# Altium project ESC_4in1.PrjPcb
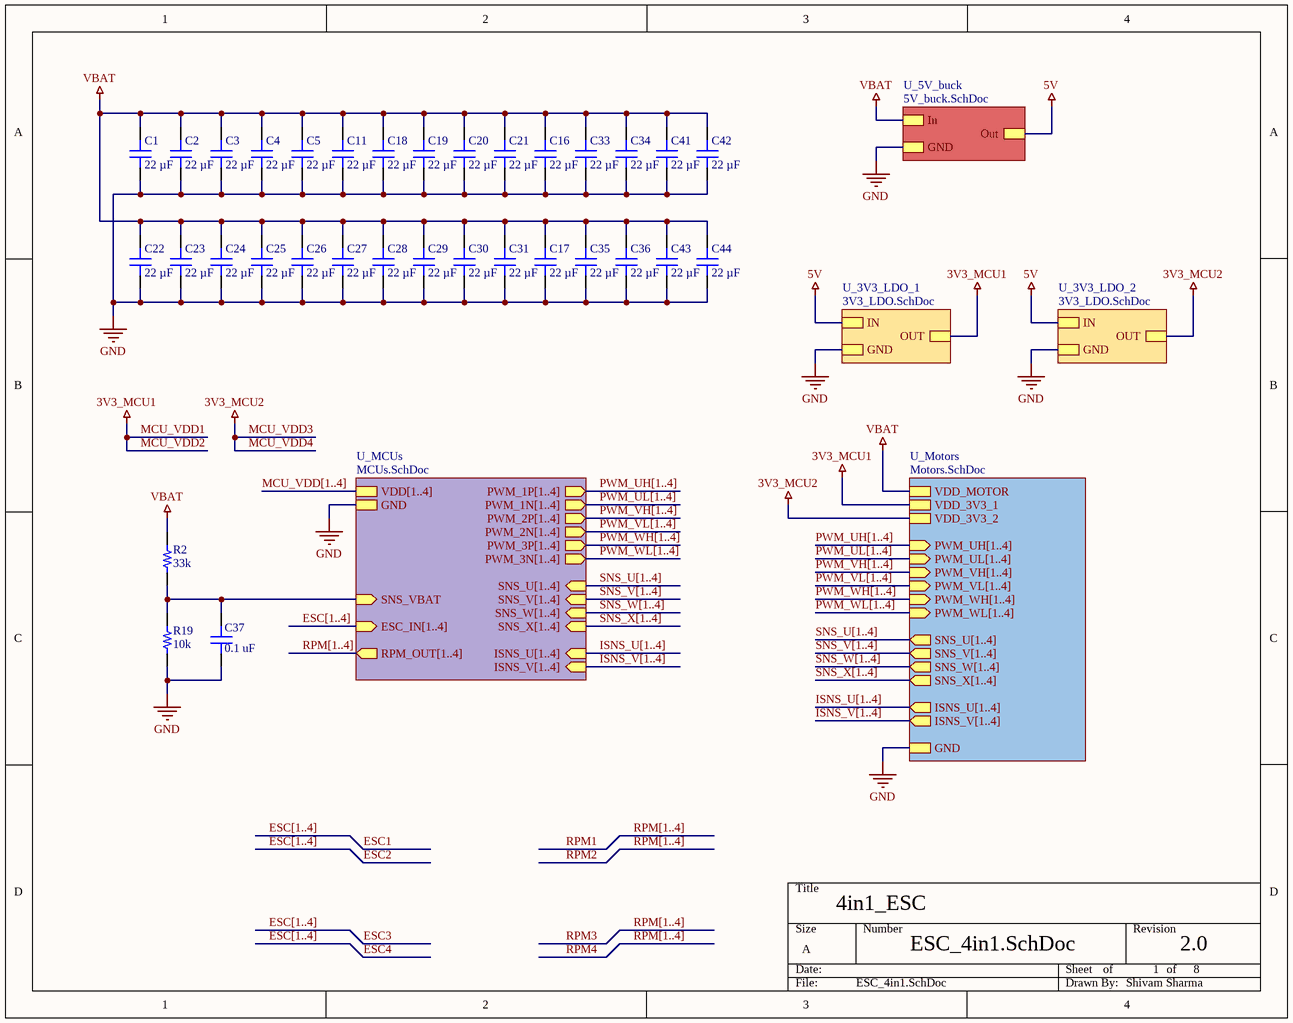
[diagram p0: ESC_4in1.SchDoc]
Revision: 2.1; Project: 4in1_ESC; DrawnBy: Shivam Sharma
8 sheets, 216 parts. Net scope: strictly hierarchical (ports join the sheet entries above them; power ports are local).
Board file: ESC_4in1_8layer.PcbDoc
Sheets:
  ESC_4in1.SchDoc
    U_5V_buck = 5V_buck.SchDoc
    U_3V3_LDO_1 = 3V3_LDO.SchDoc
    U_Motors = Motors.SchDoc
      U_MOSFETs1 = MOSFETs.SchDoc
      U_MOSFETs2 = MOSFETs.SchDoc
      U_MOSFETs3 = MOSFETs.SchDoc
      U_MOSFETs4 = MOSFETs.SchDoc
      U_Half Bridge Driver_1 = Half_Bridge_Driver.SchDoc
      U_Half Bridge Driver_2 = Half_Bridge_Driver.SchDoc
      U_Half Bridge Driver_3 = Half_Bridge_Driver.SchDoc
      U_Half Bridge Driver_4 = Half_Bridge_Driver.SchDoc
      U_CurrentSenseAmp = CurrentSenseAmp.SchDoc
      U_CurrentSenseAmp = CurrentSenseAmp.SchDoc
      U_CurrentSenseAmp = CurrentSenseAmp.SchDoc
      U_CurrentSenseAmp = CurrentSenseAmp.SchDoc
    U_MCUs = MCUs.SchDoc
    U_3V3_LDO_2 = 3V3_LDO.SchDoc

## Sheet ESC_4in1.SchDoc
size A; Revision: 2.0; SheetNumber: 1; SheetTotal: 8

### Parts
C1  22 µF  [CAP 0805_2012]
C2  22 µF  [CAP 0805_2012]
C3  22 µF  [CAP 0805_2012]
C4  22 µF  [CAP 0805_2012]
C5  22 µF  [CAP 0805_2012]
C11  22 µF  [CAP 0805_2012]
C16  22 µF  [CAP 0805_2012]
C17  22 µF  [CAP 0805_2012]
C18  22 µF  [CAP 0805_2012]
C19  22 µF  [CAP 0805_2012]
C20  22 µF  [CAP 0805_2012]
C21  22 µF  [CAP 0805_2012]
C22  22 µF  [CAP 0805_2012]
C23  22 µF  [CAP 0805_2012]
C24  22 µF  [CAP 0805_2012]
C25  22 µF  [CAP 0805_2012]
C26  22 µF  [CAP 0805_2012]
C27  22 µF  [CAP 0805_2012]
C28  22 µF  [CAP 0805_2012]
C29  22 µF  [CAP 0805_2012]
C30  22 µF  [CAP 0805_2012]
C31  22 µF  [CAP 0805_2012]
C33  22 µF  [CAP 0805_2012]
C34  22 µF  [CAP 0805_2012]
C35  22 µF  [CAP 0805_2012]
C36  22 µF  [CAP 0805_2012]
C37  0.1 uF  [CAP 0201_0603]
C41  22 µF  [CAP 0805_2012]
C42  22 µF  [CAP 0805_2012]
C43  22 µF  [CAP 0805_2012]
C44  22 µF  [CAP 0805_2012]
R2  33k  [RES 0201_0603]
R19  10k  [RES 0201_0603]

### Sub-sheets
U_3V3_LDO_1 = 3V3_LDO.SchDoc: OUT, IN, GND
U_3V3_LDO_2 = 3V3_LDO.SchDoc: OUT, IN, GND
U_5V_buck = 5V_buck.SchDoc: Out, In, GND
U_MCUs = MCUs.SchDoc: GND, PWM_1P[1..4] (out), PWM_1N[1..4] (out), PWM_2P[1..4] (out), PWM_2N[1..4] (out), PWM_3P[1..4] (out), PWM_3N[1..4] (out), SNS_U[1..4] (in), SNS_V[1..4] (in), SNS_W[1..4] (in), SNS_X[1..4] (in), ISNS_U[1..4] (in), ESC_IN[1..4] (in), RPM_OUT[1..4] (out), SNS_VBAT (in), VDD[1..4], ISNS_V[1..4] (in)
U_Motors = Motors.SchDoc: VDD_MOTOR, GND, PWM_UH[1..4] (in), PWM_UL[1..4] (in), PWM_VH[1..4] (in), PWM_VL[1..4] (in), PWM_WH[1..4] (in), PWM_WL[1..4] (in), SNS_U[1..4] (out), SNS_V[1..4] (out), SNS_W[1..4] (out), SNS_X[1..4] (out), VDD_3V3_1, ISNS_U[1..4] (out), ISNS_V[1..4] (out), VDD_3V3_2

### Nets
3V3_MCU1: sheet U_3V3_LDO_1/OUT, sheet U_Motors/VDD_3V3_1  [also labelled MCU_VDD1, MCU_VDD2]
3V3_MCU2: sheet U_Motors/VDD_3V3_2, sheet U_3V3_LDO_2/OUT  [also labelled MCU_VDD3, MCU_VDD4]
5V: sheet U_5V_buck/Out, sheet U_3V3_LDO_1/IN, sheet U_3V3_LDO_2/IN
GND: C1.1 C2.1 C3.1 C4.1 C5.1 C11.1 C16.1 C17.1 C18.1 C19.1 C20.1 C21.1 C22.1 C23.1 C24.1 C25.1 C26.1 C27.1 C28.1 C29.1 C30.1 C31.1 C33.1 C34.1 C35.1 C36.1 C37.1 C41.1 C42.1 C43.1 C44.1 R19.1 ; sheet U_5V_buck/GND, sheet U_3V3_LDO_1/GND, sheet U_Motors/GND, sheet U_MCUs/GND, sheet U_3V3_LDO_2/GND
VBAT: C1.2 C2.2 C3.2 C4.2 C5.2 C11.2 C16.2 C17.2 C18.2 C19.2 C20.2 C21.2 C22.2 C23.2 C24.2 C25.2 C26.2 C27.2 C28.2 C29.2 C30.2 C31.2 C33.2 C34.2 C35.2 C36.2 C41.2 C42.2 C43.2 C44.2 R2.2 ; sheet U_5V_buck/In, sheet U_Motors/VDD_MOTOR
SNS_VBAT: C37.2 R2.1 R19.2 ; sheet U_MCUs/SNS_VBAT

### Buses and harness runs
bus ESC[1..4]
bus ESC[1..4] = sheet U_MCUs/ESC_IN[1..4]
bus ISNS_U[1..4] = sheet U_MCUs/ISNS_U[1..4]
bus ISNS_U[1..4] = sheet U_Motors/ISNS_U[1..4]
bus ISNS_V[1..4] = sheet U_MCUs/ISNS_V[1..4]
bus ISNS_V[1..4] = sheet U_Motors/ISNS_V[1..4]
bus MCU_VDD[1..4] = sheet U_MCUs/VDD[1..4]
bus PWM_UH[1..4] = sheet U_MCUs/PWM_1P[1..4]
bus PWM_UH[1..4] = sheet U_Motors/PWM_UH[1..4]
bus PWM_UL[1..4] = sheet U_MCUs/PWM_1N[1..4]
bus PWM_UL[1..4] = sheet U_Motors/PWM_UL[1..4]
bus PWM_VH[1..4] = sheet U_MCUs/PWM_2P[1..4]
bus PWM_VH[1..4] = sheet U_Motors/PWM_VH[1..4]
bus PWM_VL[1..4] = sheet U_MCUs/PWM_2N[1..4]
bus PWM_VL[1..4] = sheet U_Motors/PWM_VL[1..4]
bus PWM_WH[1..4] = sheet U_MCUs/PWM_3P[1..4]
bus PWM_WH[1..4] = sheet U_Motors/PWM_WH[1..4]
bus PWM_WL[1..4] = sheet U_MCUs/PWM_3N[1..4]
bus PWM_WL[1..4] = sheet U_Motors/PWM_WL[1..4]
bus RPM[1..4]
bus RPM[1..4] = sheet U_MCUs/RPM_OUT[1..4]
bus SNS_U[1..4] = sheet U_MCUs/SNS_U[1..4]
bus SNS_U[1..4] = sheet U_Motors/SNS_U[1..4]
bus SNS_V[1..4] = sheet U_MCUs/SNS_V[1..4]
bus SNS_V[1..4] = sheet U_Motors/SNS_V[1..4]
bus SNS_W[1..4] = sheet U_MCUs/SNS_W[1..4]
bus SNS_W[1..4] = sheet U_Motors/SNS_W[1..4]
bus SNS_X[1..4] = sheet U_MCUs/SNS_X[1..4]
bus SNS_X[1..4] = sheet U_Motors/SNS_X[1..4]

### Notes on the sheet
- of

### Library data of the parts
C1-C5 C11 C16-C31 C33-C36 C41-C44 = CC0805MKX5R8BB226: CAP CER 22UF 25V X5R 0805; manufacturer: Yageo; Tolerance: ±20%; Part Number: CC0805MKX5R8BB226; Value: 22 µF; Applications: General Purpose; Capacitance: 22 µF; componentlink1description: Datasheet; componentlink1url: https://www.yageo.com/upload/media/product/productsearch/datasheet/mlcc/UPY-GPHC_X5R_4V-to-50V_25.pdf; componentlink2description: DigiKey Link; componentlink2url: https://www.digikey.com/en/products/detail/yageo/CC0805MKX5R8BB226/5195309; Device Package: 0805 (2012 Metric); Lifecycle Status: Active; Minimum Order: 1; Mounting Type: Surface Mount, MLCC; Operating Temperature: -55°C ~ 85°C; Package / Case: 0805 (2012 Metric); packaging: TapeAndReel; partid: 39226; Part Status: Active; price: 0.10; series: CC; Size / Dimension: 0.079" L x 0.049" W (2.00mm x 1.25mm); Supplier 1: DigiKey; Supplier Part Number 1: 311-1903-1-ND; Temperature Coefficient: X5R; Thickness (Max): 0.057" (1.45mm); Voltage - Rated: 25V
  C1-C5 C11 C16-C19 C21-C31 C33-C36 C41-C44: lastupdated: 8/21/2022 8:03:23 PM
  C20: lastupdated: 8/25/2022 6:52:09 AM
C37 = GRT033R6YA104KE01D: CAP CER 0.1UF 35V X5R 0201; manufacturer: Murata Electronics; Capacitance: 0.1 µF; Tolerance: ±10%; Part Number: GRT033R6YA104KE01D; Value: 0.1 uF; Applications: Automotive; componentlink1description: Datasheet; componentlink1url: https://search.murata.co.jp/Ceramy/image/img/A01X/G101/ENG/GRT033R6YA104KE01-01.pdf; componentlink2description: DigiKey Link; componentlink2url: https://www.digikey.com/en/products/detail/murata-electronics/GRT033R6YA104KE01D/10694796; Device Package: 0201 (0603 Metric); lastupdated: 7/15/2023 7:00:43 PM; Lifecycle Status: Active; Minimum Order: 1; Mounting Type: Surface Mount, MLCC; Operating Temperature: -55°C ~ 85°C; Package / Case: 0201 (0603 Metric); packaging: TapeAndReel; partid: 49925; Part Status: Active; price: 0.01; Ratings: AEC-Q200; series: GRT; Size / Dimension: 0.024" L x 0.012" W (0.60mm x 0.30mm); Supplier 1: DigiKey; Supplier Part Number 1: 490-GRT033R6YA104KE01DCT-ND; Temperature Coefficient: X5R; Thickness (Max): 0.013" (0.33mm); Voltage - Rated: 35V
R2 R19 = CRCW020110K0FKED: RES SMD 10K OHM 1% 1/20W 0201; Manufacturer: Vishay Dale; Power (Watts): 0.05W, 1/20W; Resistance: 10 kOhms; Temperature Coefficient: ±100ppm/°C; Part Number: CRCW020110K0FKED; ComponentLink1Description: Datasheet; ComponentLink1URL: http://www.vishay.com/docs/20052/crcw0201e3.pdf; ComponentLink2Description: DigiKey Link; ComponentLink2URL: https://www.digikey.com/en/products/detail/vishay-dale/CRCW020110K0FKED/1967989; Composition: Thick Film; Device Package: 0201 (0603 Metric); Height - Seated (Max): 0.010" (0.26mm); LastUpdated: 7/12/2023 7:17:23 PM; Lifecycle Status: Active; Minimum Order: 1; Number of Terminations: 2; Operating Temperature: -55°C ~ 155°C; Package / Case: 0201 (0603 Metric); Packaging: TapeAndReel; PartId: 29; Part Status: Active; Price: 0.02; Series: CRCW; Size / Dimension: 0.024" L x 0.012" W (0.60mm x 0.30mm); Supplier 1: DigiKey; Supplier Part Number 1: 541-10.0KAABCT-ND; Supplier Device Package: 0201; Tolerance: ±1%
  R2: Value: 33k
  R19: Value: 10k

## Sheet 5V_buck.SchDoc
size A; SheetNumber: 3; SheetTotal: 8
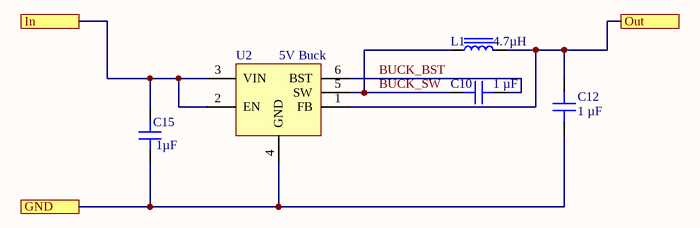
[diagram p1: 5V_buck.SchDoc]

### Parts
C10  1 µF  [CAP 0402_1005]
C12  1 µF  [CAP 0402_1005]
C15  1µF  [CAP 0603_1608]
L1  4.7µH  [IND 1008_2520]
U2  5V Buck  [TSOT-26-6 - 3.2mm]

### Ports
GND, In, Out

### Nets
5V: C12.2 L1.2 U2.1(FB) ; port Out
GND: C12.1 C15.2 U2.4(GND) ; port GND
VBAT: C15.1 U2.2(EN) U2.3(VIN) ; port In
BUCK_BST: C10.2 U2.6(BST)
BUCK_SW: C10.1 L1.1 U2.5(SW)

### Library data of the parts
C10 C12 = C0402C104K4RACAUTO: CAP CER 0.1UF 16V X7R 0402; manufacturer: KEMET; Capacitance: 0.1 µF; Tolerance: ±10%; Part Number: C0402C104K4RACAUTO; Value: 1 µF; Applications: Automotive, Bypass, Decoupling; componentlink1description: Datasheet; componentlink1url: https://api.kemet.com/component-edge/download/specsheet/C0402C104K4RACAUTO.pdf; componentlink2description: DigiKey Link; componentlink2url: https://www.digikey.com/en/products/detail/kemet/C0402C104K4RACAUTO/3314827; Device Package: 0402 (1005 Metric); lastupdated: 8/14/2022 9:05:51 PM; Lifecycle Status: Active; Minimum Order: 1; Mounting Type: Surface Mount, MLCC; Operating Temperature: -55°C ~ 125°C; Package / Case: 0402 (1005 Metric); packaging: TapeAndReel; partid: 3024; Part Status: Active; price: 0.01; Ratings: AEC-Q200; series: SMD Auto X7R; Size / Dimension: 0.039" L x 0.020" W (1.00mm x 0.50mm); Supplier 1: DigiKey; Supplier Part Number 1: 399-6828-1-ND; Temperature Coefficient: X7R; Thickness (Max): 0.022" (0.55mm); Voltage - Rated: 16V
C15 = GCG188R92A104KA03D: CAP CER 0.1UF 100V 0603 EPOXY; Manufacturer: Murata Electronics; Capacitance: 0.1µF; Temperature Coefficient: X8R; Tolerance: ±10%; Part Number: GCG188R92A104KA03D; Value: 1µF; Applications: Automotive; ComponentLink1Description: Datasheet; ComponentLink1URL: https://search.murata.co.jp/Ceramy/image/img/A01X/G101/ENG/GCG188R92A104KA03-01.pdf; ComponentLink2Description: DigiKey Link; ComponentLink2URL: http://digikey.com/product-detail/en/murata-electronics/GCG188R92A104KA03D/490-18197-1-ND/9867926; Device Package: 0603 (1608 Metric); Features: Epoxy Mountable; LastUpdated: 21-Jan-20 12:01:59 AM; Lifecycle Status: Active; Minimum Order: 1; Mounting Type: Surface Mount, MLCC, Epoxy; Operating Temperature: -55°C ~ 150°C; Package / Case: 0603 (1608 Metric); Packaging: TapeAndReel; PartId: 9025; Part Status: Active; Price: 0.07; Ratings: AEC-Q200; Series: GCG; Size / Dimension: 0.063" L x 0.031" W (1.60mm x 0.80mm); Supplier 1: DigiKey; Supplier Part Number 1: 490-18197-1-ND; Thickness (Max): 0.035" (0.90mm); Voltage - Rated: 100V
L1 = MLP2520S4R7ST0S1: FIXED IND 4.7UH 1A 110 MOHM SMD; Manufacturer: TDK Corporation; DC Resistance (DCR): 143mOhm Max; Inductance Frequency - Test: 2MHz; Material - Core: Ferrite; Shielding: Shielded; Tolerance: ±20%; Type: Multilayer; Part Number: MLP2520S4R7ST0S1; ComponentLink1Description: Datasheet; ComponentLink1URL: https://product.tdk.com/info/en/catalog/datasheets/inductor_commercial_power_mlp2520_en.pdf?ref_disty=digikey; ComponentLink2Description: DigiKey Link; ComponentLink2URL: http://digikey.com/product-detail/en/tdk-corporation/MLP2520S4R7ST0S1/445-6378-1-ND/2465705; Current Rating (Amps): 1A; Device Package: 1008 (2520 Metric); Height - Seated (Max): 0.039" (1.00mm); Inductance: 4.7µH; LastUpdated: 13-Aug-20 11:03:40 AM; Lifecycle Status: Active; Minimum Order: 1; Mounting Type: Surface Mount; Operating Temperature: -40°C ~ 125°C; Package / Case: 1008 (2520 Metric); Packaging: TapeAndReel; PartId: 3467; Part Status: Active; Price: 0.14; Series: MLP; Size / Dimension: 0.098" L x 0.079" W (2.50mm x 2.00mm); Supplier 1: DigiKey; Supplier Part Number 1: 445-6378-1-ND; Supplier Device Package: 1008 (2520 Metric); Value: 4.7µH
U2 = AP63205WU-7: 5V fixed step down Buck

## Sheet 3V3_LDO.SchDoc
size A; SheetNumber: 2; SheetTotal: 8
Used 2 times, as channels U_3V3_LDO_1, U_3V3_LDO_2. Parts and nets are listed once, with the designators drawn on the sheet.
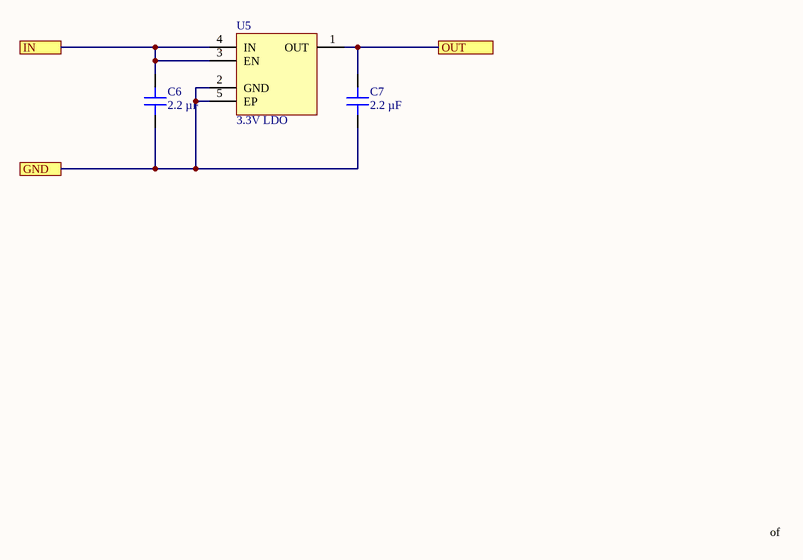
[diagram p2: 3V3_LDO.SchDoc]

### Parts
C6  2.2 µF  [CAP 0201_0603]
C7  2.2 µF  [CAP 0201_0603]
U5  3.3V LDO  [XDFN-4]

### Ports
GND, IN, OUT

### Nets
GND: C6.2 C7.2 U5.2(GND) U5.5(EP) ; port GND
IN: C6.1 U5.3(EN) U5.4(IN) ; port IN
OUT: C7.1 U5.1(OUT) ; port OUT

### Channels
U_3V3_LDO_1: designators end in _1; ports GND=GND IN=5V OUT=3V3_MCU1
U_3V3_LDO_2: designators end in _2; ports GND=GND IN=5V OUT=3V3_MCU2

### Notes on the sheet
- of

### Library data of the parts
C6 C7 = GRT033R6YA104KE01D: as C37 on sheet ESC_4in1; Part Number: GRT033R6YA104KE01D; Value: 2.2 µF; Applications: Automotive; componentlink1description: Datasheet; componentlink1url: https://search.murata.co.jp/Ceramy/image/img/A01X/G101/ENG/GRT033R6YA104KE01-01.pdf; componentlink2description: DigiKey Link; componentlink2url: https://www.digikey.com/en/products/detail/murata-electronics/GRT033R6YA104KE01D/10694796; Device Package: 0201 (0603 Metric); lastupdated: 7/15/2023 7:00:43 PM; Lifecycle Status: Active; Minimum Order: 1; Mounting Type: Surface Mount, MLCC; Operating Temperature: -55°C ~ 85°C; Package / Case: 0201 (0603 Metric); packaging: TapeAndReel; partid: 49925; Part Status: Active; price: 0.01; Ratings: AEC-Q200; series: GRT; Size / Dimension: 0.024" L x 0.012" W (0.60mm x 0.30mm); Supplier 1: DigiKey; Supplier Part Number 1: 490-GRT033R6YA104KE01DCT-ND; Temperature Coefficient: X5R; Thickness (Max): 0.013" (0.33mm); Voltage - Rated: 35V
U5 = TLV74033PDQNR

## Sheet Motors.SchDoc
size B; SheetNumber: 4; SheetTotal: 8
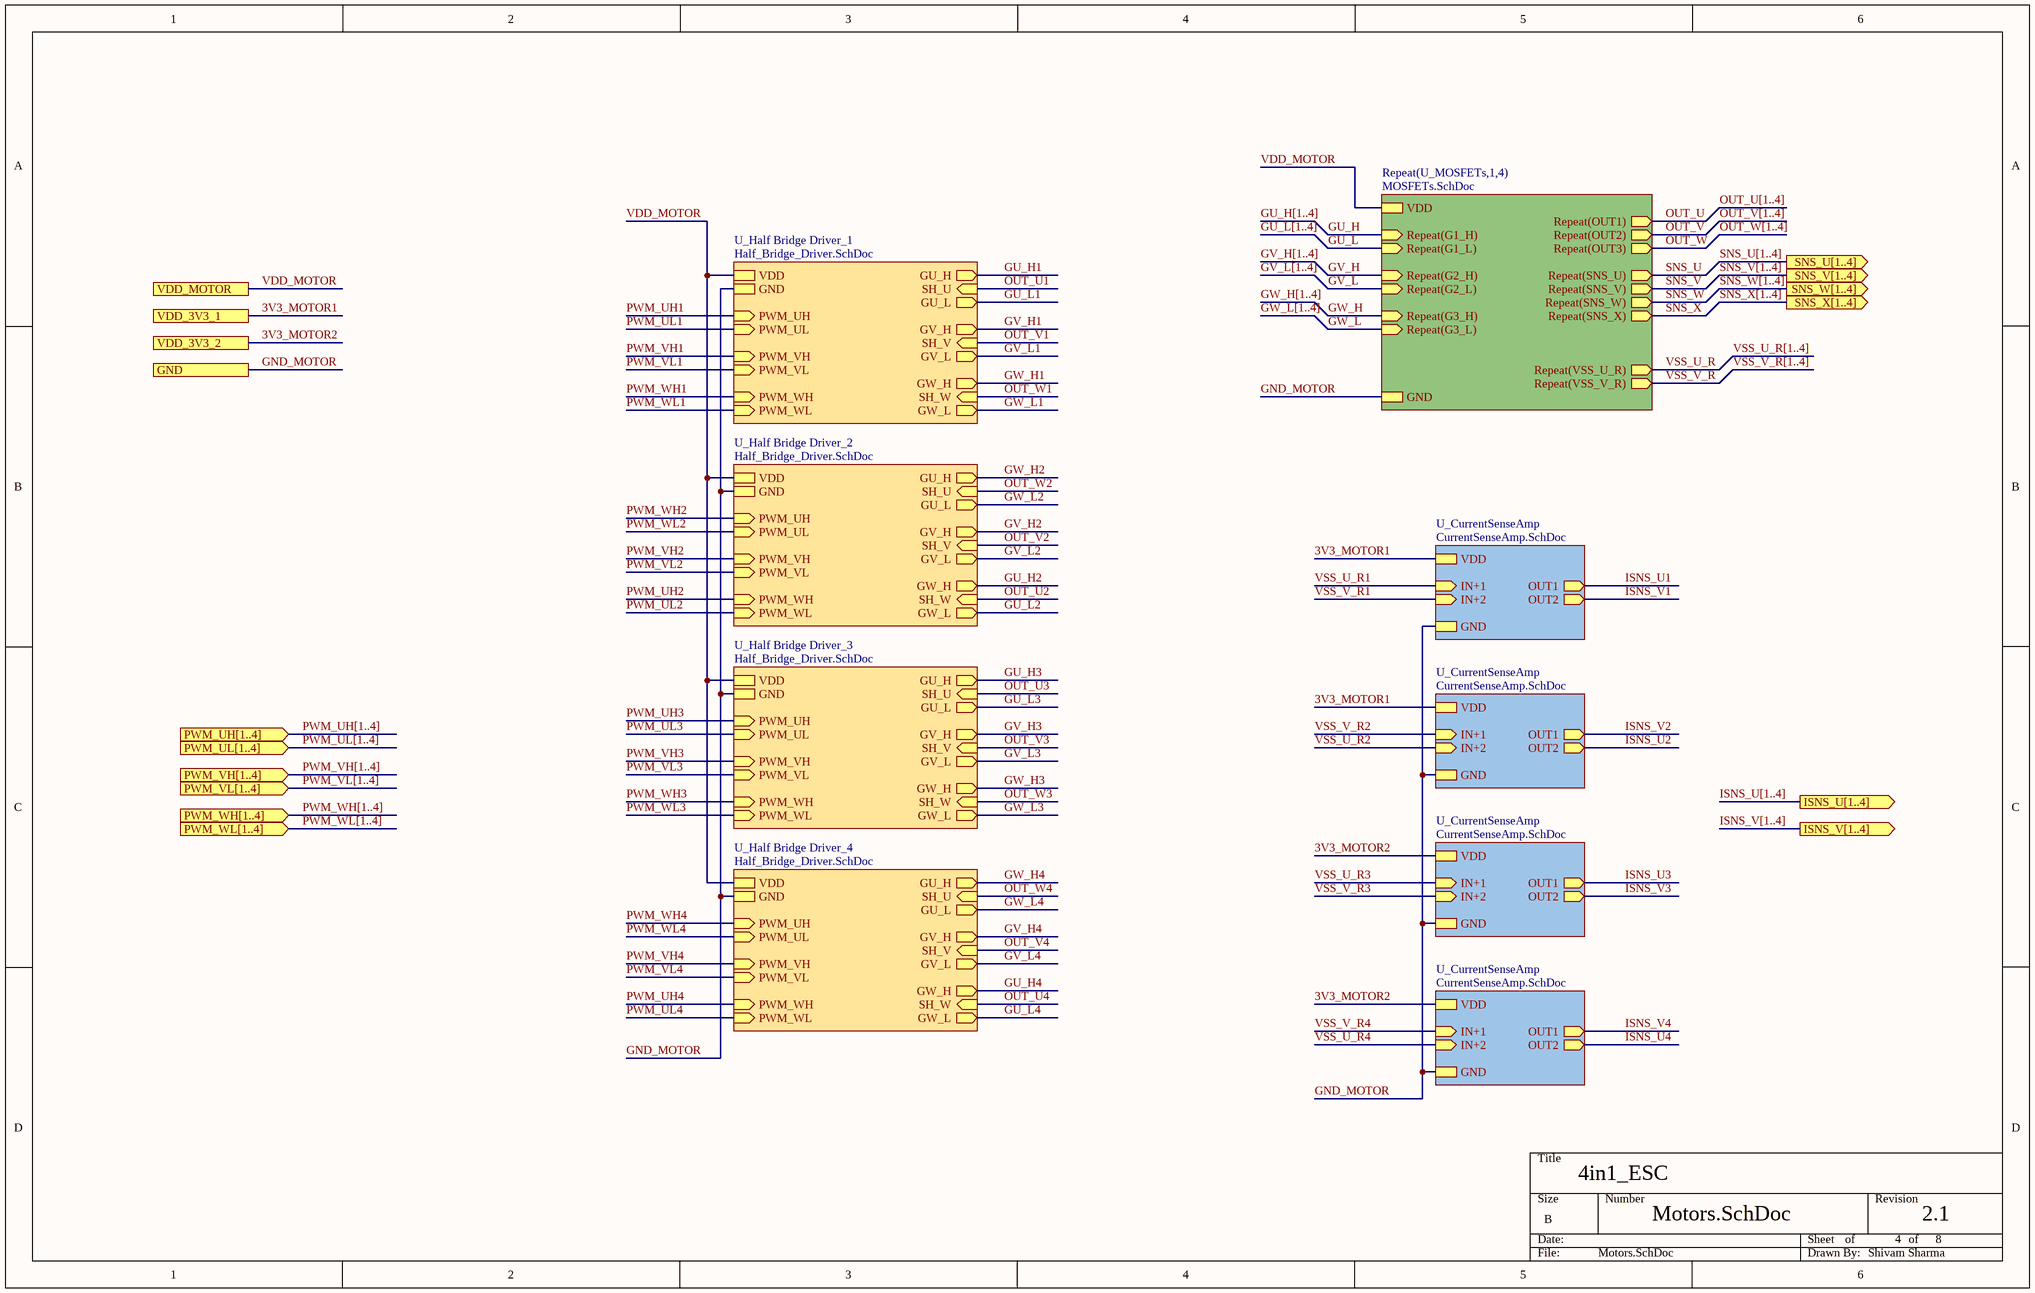
[diagram p3: Motors.SchDoc]

### Sub-sheets
Repeat(U_MOSFETs,1,4) = MOSFETs.SchDoc: Repeat(G2_H) (in), Repeat(G2_L) (in), Repeat(G1_L) (in), Repeat(G1_H) (in), Repeat(G3_H) (in), Repeat(G3_L) (in), Repeat(OUT1) (out), Repeat(OUT2) (out), Repeat(OUT3) (out), VDD, GND, Repeat(SNS_U) (out), Repeat(SNS_V) (out), Repeat(SNS_W) (out), Repeat(SNS_X) (out), Repeat(VSS_U_R) (out), Repeat(VSS_V_R) (out)
U_CurrentSenseAmp = CurrentSenseAmp.SchDoc: VDD, GND, IN+1 (in), IN+2 (in), OUT1 (out), OUT2 (out)
U_CurrentSenseAmp = CurrentSenseAmp.SchDoc: VDD, GND, IN+1 (in), IN+2 (in), OUT1 (out), OUT2 (out)
U_CurrentSenseAmp = CurrentSenseAmp.SchDoc: VDD, GND, IN+1 (in), IN+2 (in), OUT1 (out), OUT2 (out)
U_CurrentSenseAmp = CurrentSenseAmp.SchDoc: VDD, GND, IN+1 (in), IN+2 (in), OUT1 (out), OUT2 (out)
U_Half Bridge Driver_1 = Half_Bridge_Driver.SchDoc: VDD, GND, PWM_UH (in), PWM_UL (in), PWM_VH (in), PWM_VL (in), PWM_WH (in), PWM_WL (in), GU_H (out), GU_L (out), SH_U (in), GV_H (out), GV_L (out), SH_V (in), GW_H (out), GW_L (out), SH_W (in)
U_Half Bridge Driver_2 = Half_Bridge_Driver.SchDoc: VDD, GND, PWM_UH (in), PWM_UL (in), PWM_VH (in), PWM_VL (in), PWM_WH (in), PWM_WL (in), GU_H (out), GU_L (out), SH_U (in), GV_H (out), GV_L (out), SH_V (in), GW_H (out), GW_L (out), SH_W (in)
U_Half Bridge Driver_3 = Half_Bridge_Driver.SchDoc: VDD, GND, PWM_UH (in), PWM_UL (in), PWM_VH (in), PWM_VL (in), PWM_WH (in), PWM_WL (in), GU_H (out), GU_L (out), SH_U (in), GV_H (out), GV_L (out), SH_V (in), GW_H (out), GW_L (out), SH_W (in)
U_Half Bridge Driver_4 = Half_Bridge_Driver.SchDoc: VDD, GND, PWM_UH (in), PWM_UL (in), PWM_VH (in), PWM_VL (in), PWM_WH (in), PWM_WL (in), GU_H (out), GU_L (out), SH_U (in), GV_H (out), GV_L (out), SH_V (in), GW_H (out), GW_L (out), SH_W (in)

### Ports
GND, ISNS_U[1..4] (out), ISNS_V[1..4] (out), PWM_UH[1..4] (in), PWM_UL[1..4] (in), PWM_VH[1..4] (in), PWM_VL[1..4] (in), PWM_WH[1..4] (in), PWM_WL[1..4] (in), SNS_U[1..4] (out), SNS_V[1..4] (out), SNS_W[1..4] (out), SNS_X[1..4] (out), VDD_3V3_1, VDD_3V3_2, VDD_MOTOR

### Nets
3V3_MOTOR1: port VDD_3V3_1, sheet U_CurrentSenseAmp/VDD, sheet U_CurrentSenseAmp/VDD  [project net 3V3_MCU1]
3V3_MOTOR2: port VDD_3V3_2, sheet U_CurrentSenseAmp/VDD, sheet U_CurrentSenseAmp/VDD  [project net 3V3_MCU2]
GND_MOTOR: port GND, sheet Repeat(U_MOSFETs,1,4)/GND, sheet U_Half Bridge Driver_1/GND, sheet U_Half Bridge Driver_2/GND, sheet U_Half Bridge Driver_3/GND, sheet U_Half Bridge Driver_4/GND, sheet U_CurrentSenseAmp/GND, sheet U_CurrentSenseAmp/GND, sheet U_CurrentSenseAmp/GND, sheet U_CurrentSenseAmp/GND  [project net GND]
VDD_MOTOR: port VDD_MOTOR, sheet Repeat(U_MOSFETs,1,4)/VDD, sheet U_Half Bridge Driver_1/VDD, sheet U_Half Bridge Driver_2/VDD, sheet U_Half Bridge Driver_3/VDD, sheet U_Half Bridge Driver_4/VDD  [project net VBAT]
GU_H: sheet Repeat(U_MOSFETs,1,4)/Repeat(G1_H)
GU_L: sheet Repeat(U_MOSFETs,1,4)/Repeat(G1_L)
GV_H: sheet Repeat(U_MOSFETs,1,4)/Repeat(G2_H)
GV_L: sheet Repeat(U_MOSFETs,1,4)/Repeat(G2_L)
GW_H: sheet Repeat(U_MOSFETs,1,4)/Repeat(G3_H)
GW_L: sheet Repeat(U_MOSFETs,1,4)/Repeat(G3_L)
OUT_U: sheet Repeat(U_MOSFETs,1,4)/Repeat(OUT1)
OUT_V: sheet Repeat(U_MOSFETs,1,4)/Repeat(OUT2)
OUT_W: sheet Repeat(U_MOSFETs,1,4)/Repeat(OUT3)
SNS_U: sheet Repeat(U_MOSFETs,1,4)/Repeat(SNS_U)
SNS_V: sheet Repeat(U_MOSFETs,1,4)/Repeat(SNS_V)
SNS_W: sheet Repeat(U_MOSFETs,1,4)/Repeat(SNS_W)
SNS_X: sheet Repeat(U_MOSFETs,1,4)/Repeat(SNS_X)
VSS_U_R: sheet Repeat(U_MOSFETs,1,4)/Repeat(VSS_U_R)
VSS_V_R: sheet Repeat(U_MOSFETs,1,4)/Repeat(VSS_V_R)

### Buses and harness runs
bus GU_H[1..4]
bus GU_L[1..4]
bus GV_H[1..4]
bus GV_L[1..4]
bus GW_H[1..4]
bus GW_L[1..4]
bus ISNS_U[1..4] = port ISNS_U[1..4]
bus ISNS_V[1..4] = port ISNS_V[1..4]
bus OUT_U[1..4]
bus OUT_V[1..4]
bus OUT_W[1..4]
bus PWM_UH[1..4] = port PWM_UH[1..4]
bus PWM_UL[1..4] = port PWM_UL[1..4]
bus PWM_VH[1..4] = port PWM_VH[1..4]
bus PWM_VL[1..4] = port PWM_VL[1..4]
bus PWM_WH[1..4] = port PWM_WH[1..4]
bus PWM_WL[1..4] = port PWM_WL[1..4]
bus SNS_U[1..4] = port SNS_U[1..4]
bus SNS_V[1..4] = port SNS_V[1..4]
bus SNS_W[1..4] = port SNS_W[1..4]
bus SNS_X[1..4] = port SNS_X[1..4]
bus VSS_U_R[1..4]
bus VSS_V_R[1..4]

### Notes on the sheet
- of

## Sheet MOSFETs.SchDoc
size A; SheetNumber: 5; SheetTotal: 8
Used 4 times, as channels U_Motors/U_MOSFETs1, U_Motors/U_MOSFETs2, U_Motors/U_MOSFETs3, U_Motors/U_MOSFETs4. Parts and nets are listed once, with the designators drawn on the sheet.
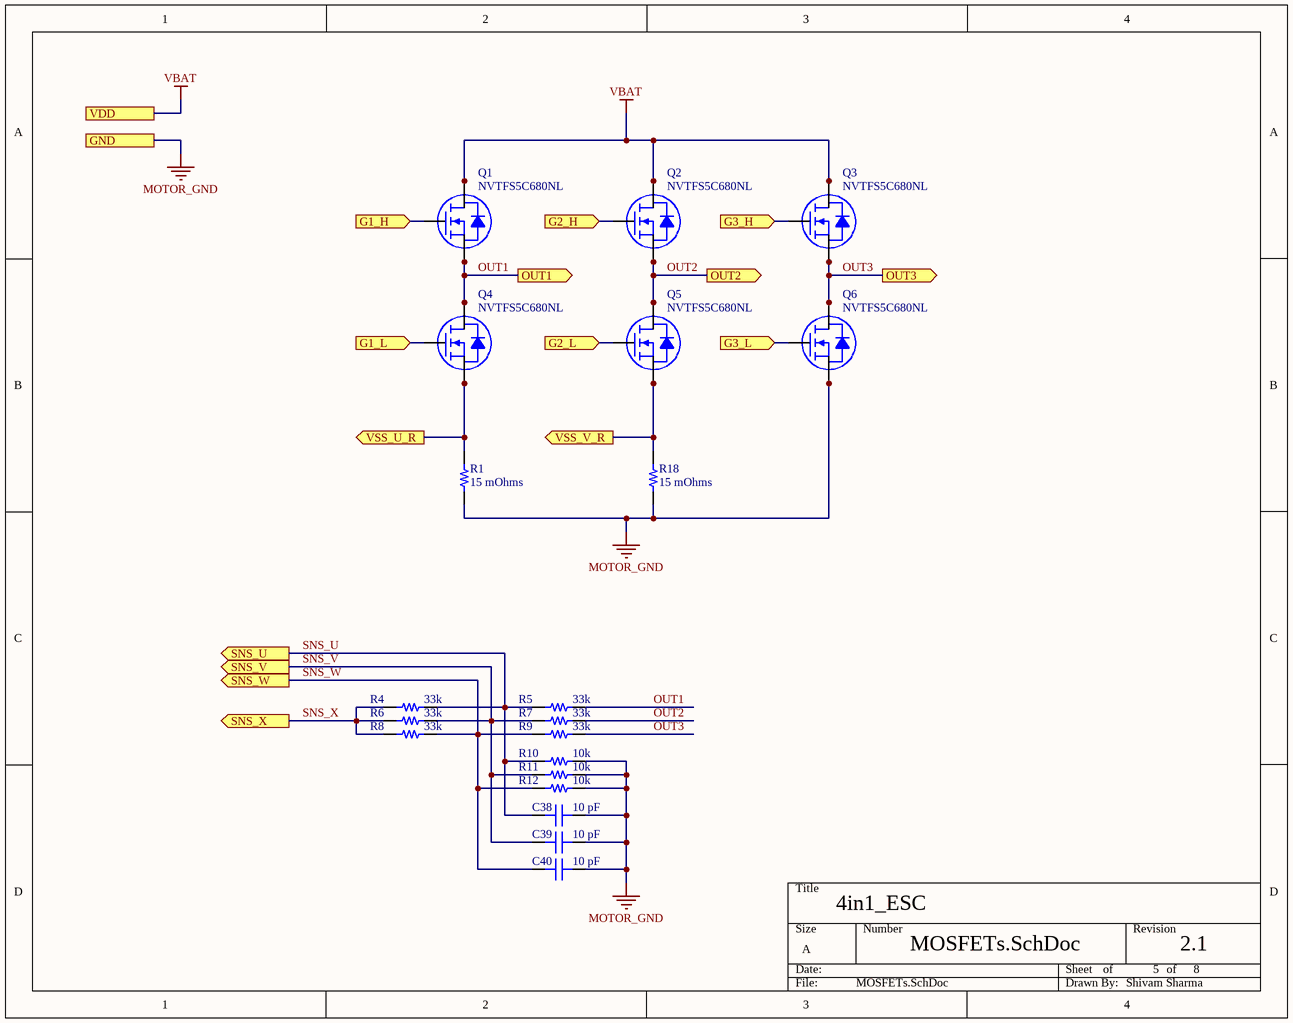
[diagram p4: MOSFETs.SchDoc]

### Parts
C38  10 pF  [CAP 0201_0603]
C39  10 pF  [CAP 0201_0603]
C40  10 pF  [CAP 0201_0603]
Q1  NVTFS5C680NL  [NVTFS015N04CTAG]
Q2  NVTFS5C680NL  [NVTFS015N04CTAG]
Q3  NVTFS5C680NL  [NVTFS015N04CTAG]
Q4  NVTFS5C680NL  [NVTFS015N04CTAG]
Q5  NVTFS5C680NL  [NVTFS015N04CTAG]
Q6  NVTFS5C680NL  [NVTFS015N04CTAG]
R1  15 mOhms  [RES 0805_2012]
R4  33k  [RES 0201_0603]
R5  33k  [RES 0201_0603]
R6  33k  [RES 0201_0603]
R7  33k  [RES 0201_0603]
R8  33k  [RES 0201_0603]
R9  33k  [RES 0201_0603]
R10  10k  [RES 0201_0603]
R11  10k  [RES 0201_0603]
R12  10k  [RES 0201_0603]
R18  15 mOhms  [RES 0805_2012]

### Ports
G1_H (in), G1_L (in), G2_H (in), G2_L (in), G3_H (in), G3_L (in), GND, OUT1 (out), OUT2 (out), OUT3 (out), SNS_U (out), SNS_V (out), SNS_W (out), SNS_X (out), VDD, VSS_U_R (out), VSS_V_R (out)

### Nets
MOTOR_GND: C38.2 C39.2 C40.2 Q6.1(S) Q6.2(S) Q6.3(S) R1.1 R10.2 R11.2 R12.2 R18.1 ; port GND
VBAT: Q1.5(D) Q1.6(D) Q1.7(D) Q1.8(D) Q2.5(D) Q2.6(D) Q2.7(D) Q2.8(D) Q3.5(D) Q3.6(D) Q3.7(D) Q3.8(D) ; port VDD
G1_H: Q1.4(G) ; port G1_H
G1_L: Q4.4(G) ; port G1_L
G2_H: Q2.4(G) ; port G2_H
G2_L: Q5.4(G) ; port G2_L
G3_H: Q3.4(G) ; port G3_H
G3_L: Q6.4(G) ; port G3_L
OUT1: Q1.1(S) Q1.2(S) Q1.3(S) Q4.5(D) Q4.6(D) Q4.7(D) Q4.8(D) R5.2 ; port OUT1
OUT2: Q2.1(S) Q2.2(S) Q2.3(S) Q5.5(D) Q5.6(D) Q5.7(D) Q5.8(D) R7.2 ; port OUT2
OUT3: Q3.1(S) Q3.2(S) Q3.3(S) Q6.5(D) Q6.6(D) Q6.7(D) Q6.8(D) R9.2 ; port OUT3
SNS_U: C38.1 R4.2 R5.1 R10.1 ; port SNS_U
SNS_V: C39.1 R6.2 R7.1 R11.1 ; port SNS_V
SNS_W: C40.1 R8.2 R9.1 R12.1 ; port SNS_W
SNS_X: R4.1 R6.1 R8.1 ; port SNS_X
VSS_U_R: Q4.1(S) Q4.2(S) Q4.3(S) R1.2 ; port VSS_U_R
VSS_V_R: Q5.1(S) Q5.2(S) Q5.3(S) R18.2 ; port VSS_V_R

### Channels
U_Motors/U_MOSFETs1: designators end in _1; ports G1_H=GU_H1 G1_L=GU_L1 G2_H=GV_H1 G2_L=GV_L1 G3_H=GW_H1 G3_L=GW_L1 GND=GND OUT1=OUT_U1 OUT2=OUT_V1 OUT3=OUT_W1 SNS_U=SNS_U1 SNS_V=SNS_V1 SNS_W=SNS_W1 SNS_X=SNS_X1 VDD=VBAT VSS_U_R=VSS_U_R1 VSS_V_R=VSS_V_R1
U_Motors/U_MOSFETs2: designators end in _2; ports G1_H=GU_H2 G1_L=GU_L2 G2_H=GV_H2 G2_L=GV_L2 G3_H=GW_H2 G3_L=GW_L2 GND=GND OUT1=OUT_U2 OUT2=OUT_V2 OUT3=OUT_W2 SNS_U=SNS_U2 SNS_V=SNS_V2 SNS_W=SNS_W2 SNS_X=SNS_X2 VDD=VBAT VSS_U_R=VSS_U_R2 VSS_V_R=VSS_V_R2
U_Motors/U_MOSFETs3: designators end in _3; ports G1_H=GU_H3 G1_L=GU_L3 G2_H=GV_H3 G2_L=GV_L3 G3_H=GW_H3 G3_L=GW_L3 GND=GND OUT1=OUT_U3 OUT2=OUT_V3 OUT3=OUT_W3 SNS_U=SNS_U3 SNS_V=SNS_V3 SNS_W=SNS_W3 SNS_X=SNS_X3 VDD=VBAT VSS_U_R=VSS_U_R3 VSS_V_R=VSS_V_R3
U_Motors/U_MOSFETs4: designators end in _4; ports G1_H=GU_H4 G1_L=GU_L4 G2_H=GV_H4 G2_L=GV_L4 G3_H=GW_H4 G3_L=GW_L4 GND=GND OUT1=OUT_U4 OUT2=OUT_V4 OUT3=OUT_W4 SNS_U=SNS_U4 SNS_V=SNS_V4 SNS_W=SNS_W4 SNS_X=SNS_X4 VDD=VBAT VSS_U_R=VSS_U_R4 VSS_V_R=VSS_V_R4

### Notes on the sheet
- of

### Library data of the parts
C38-C40 = GRT033R6YA104KE01D: as C37 on sheet ESC_4in1; Part Number: GRT033R6YA104KE01D; Value: 10 pF; Applications: Automotive; componentlink1description: Datasheet; componentlink1url: https://search.murata.co.jp/Ceramy/image/img/A01X/G101/ENG/GRT033R6YA104KE01-01.pdf; componentlink2description: DigiKey Link; componentlink2url: https://www.digikey.com/en/products/detail/murata-electronics/GRT033R6YA104KE01D/10694796; Device Package: 0201 (0603 Metric); lastupdated: 7/15/2023 7:00:43 PM; Lifecycle Status: Active; Minimum Order: 1; Mounting Type: Surface Mount, MLCC; Operating Temperature: -55°C ~ 85°C; Package / Case: 0201 (0603 Metric); packaging: TapeAndReel; partid: 49925; Part Status: Active; price: 0.01; Ratings: AEC-Q200; series: GRT; Size / Dimension: 0.024" L x 0.012" W (0.60mm x 0.30mm); Supplier 1: DigiKey; Supplier Part Number 1: 490-GRT033R6YA104KE01DCT-ND; Temperature Coefficient: X5R; Thickness (Max): 0.013" (0.33mm); Voltage - Rated: 35V
Q1-Q6 = NVTFS5C680NL: N-FET
R1 R18 = PCAN0805E2002BST5: RES SMD 20K OHM 0.1% 1W 0805; Manufacturer: Vishay Thin Film; Resistance: 20 kOhms; Temperature Coefficient: ±25ppm/°C; Part Number: PCAN0805E2002BST5; Value: 15 mOhms; ComponentLink1Description: Datasheet; ComponentLink1URL: http://www.vishay.com/docs/60125/pcan.pdf; ComponentLink2Description: DigiKey Link; ComponentLink2URL: http://digikey.com/product-detail/en/vishay-thin-film/PCAN0805E2002BST5/764-1242-1-ND/6003316; Composition: Thin Film; Device Package: 0805 (2012 Metric); Features: Flame Proof, Moisture Resistant, Safety; Height - Seated (Max): 0.018" (0.46mm); LastUpdated: 8/26/2022 12:02:22 PM; Lifecycle Status: Active; Minimum Order: 1; Number of Terminations: 2; Operating Temperature: -55°C ~ 155°C; Package / Case: 0805 (2012 Metric); Packaging: TapeAndReel; PartId: 32096; Part Status: Active; Power (Watts): 1W; Price: 0.59; Series: PCAN; Size / Dimension: 0.080" L x 0.050" W (2.03mm x 1.27mm); Supplier 1: DigiKey; Supplier Part Number 1: 764-1242-1-ND; Supplier Device Package: 0805; Tolerance: ±0.1%
R4-R12 = CRCW020110K0FKED: as R2 on sheet ESC_4in1; Part Number: CRCW020110K0FKED; ComponentLink1Description: Datasheet; ComponentLink1URL: http://www.vishay.com/docs/20052/crcw0201e3.pdf; ComponentLink2Description: DigiKey Link; ComponentLink2URL: https://www.digikey.com/en/products/detail/vishay-dale/CRCW020110K0FKED/1967989; Composition: Thick Film; Device Package: 0201 (0603 Metric); Height - Seated (Max): 0.010" (0.26mm); LastUpdated: 7/12/2023 7:17:23 PM; Lifecycle Status: Active; Minimum Order: 1; Number of Terminations: 2; Operating Temperature: -55°C ~ 155°C; Package / Case: 0201 (0603 Metric); Packaging: TapeAndReel; PartId: 29; Part Status: Active; Price: 0.02; Series: CRCW; Size / Dimension: 0.024" L x 0.012" W (0.60mm x 0.30mm); Supplier 1: DigiKey; Supplier Part Number 1: 541-10.0KAABCT-ND; Supplier Device Package: 0201; Tolerance: ±1%
  R4-R9: Value: 33k
  R10-R12: Value: 10k

## Sheet Half_Bridge_Driver.SchDoc
size A; SheetNumber: 6; SheetTotal: 8
Used 4 times, as channels U_Motors/U_Half Bridge Driver_1, U_Motors/U_Half Bridge Driver_2, U_Motors/U_Half Bridge Driver_3, U_Motors/U_Half Bridge Driver_4. Parts and nets are listed once, with the designators drawn on the sheet.
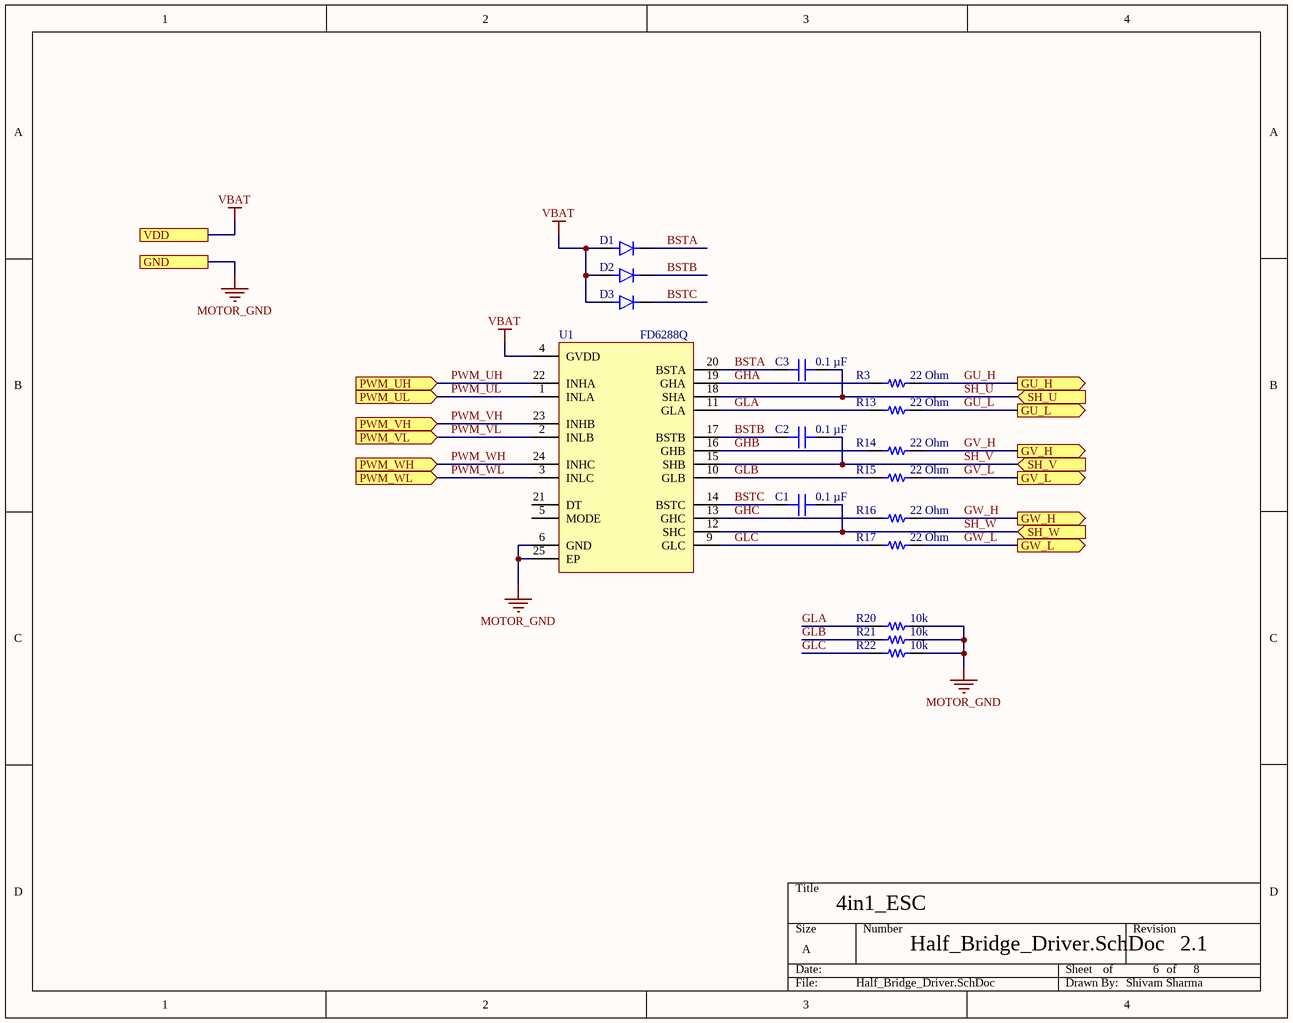
[diagram p5: Half_Bridge_Driver.SchDoc]

### Parts
C1  0.1 µF  [CAP 0201_0603]
C2  0.1 µF  [CAP 0201_0603]
C3  0.1 µF  [CAP 0201_0603]
D1  Diode  [Diode DFN1608D-2 (SOD1608)]  (value not drawn)
D2  Diode  [Diode DFN1608D-2 (SOD1608)]  (value not drawn)
D3  Diode  [Diode DFN1608D-2 (SOD1608)]  (value not drawn)
R3  22 Ohm  [RES 0402_1005]
R13  22 Ohm  [RES 0402_1005]
R14  22 Ohm  [RES 0402_1005]
R15  22 Ohm  [RES 0402_1005]
R16  22 Ohm  [RES 0402_1005]
R17  22 Ohm  [RES 0402_1005]
R20  10k  [RES 0201_0603]
R21  10k  [RES 0201_0603]
R22  10k  [RES 0201_0603]
U1  FD6288Q  [QFN50P400X400X100-25N]

### Ports
GND, GU_H (out), GU_L (out), GV_H (out), GV_L (out), GW_H (out), GW_L (out), PWM_UH (in), PWM_UL (in), PWM_VH (in), PWM_VL (in), PWM_WH (in), PWM_WL (in), SH_U (in), SH_V (in), SH_W (in), VDD

### Nets
MOTOR_GND: R20.2 R21.2 R22.2 U1.6(GND) U1.25(EP) ; port GND
VBAT: D1.2(BLUE(C)) D2.2(BLUE(C)) D3.2(BLUE(C)) U1.4(GVDD) ; port VDD
BSTA: C3.1 D1.1(A) U1.20(BSTA)
BSTB: C2.1 D2.1(A) U1.17(BSTB)
BSTC: C1.1 D3.1(A) U1.14(BSTC)
GHA: R3.1 U1.19(GHA)
GHB: R14.1 U1.16(GHB)
GHC: R16.1 U1.13(GHC)
GLA: R13.1 R20.1 U1.11(GLA)
GLB: R15.1 R21.1 U1.10(GLB)
GLC: R17.1 R22.1 U1.9(GLC)
GU_H: R3.2 ; port GU_H
GU_L: R13.2 ; port GU_L
GV_H: R14.2 ; port GV_H
GV_L: R15.2 ; port GV_L
GW_H: R16.2 ; port GW_H
GW_L: R17.2 ; port GW_L
PWM_UH: U1.22(INHA) ; port PWM_UH
PWM_UL: U1.1(INLA) ; port PWM_UL
PWM_VH: U1.23(INHB) ; port PWM_VH
PWM_VL: U1.2(INLB) ; port PWM_VL
PWM_WH: U1.24(INHC) ; port PWM_WH
PWM_WL: U1.3(INLC) ; port PWM_WL
SH_U: C3.2 U1.18(SHA) ; port SH_U
SH_V: C2.2 U1.15(SHB) ; port SH_V
SH_W: C1.2 U1.12(SHC) ; port SH_W

Not connected (* = marked no-connect by the designer): U1 5(MODE) 21(DT)

### Channels
U_Motors/U_Half Bridge Driver_1: designators end in _1; ports GND=GND GU_H=GU_H1 GU_L=GU_L1 GV_H=GV_H1 GV_L=GV_L1 GW_H=GW_H1 GW_L=GW_L1 PWM_UH=PWM_UH1 PWM_UL=PWM_UL1 PWM_VH=PWM_VH1 PWM_VL=PWM_VL1 PWM_WH=PWM_WH1 PWM_WL=PWM_WL1 SH_U=OUT_U1 SH_V=OUT_V1 SH_W=OUT_W1 VDD=VBAT
U_Motors/U_Half Bridge Driver_2: designators end in _2; ports GND=GND GU_H=GW_H2 GU_L=GW_L2 GV_H=GV_H2 GV_L=GV_L2 GW_H=GU_H2 GW_L=GU_L2 PWM_UH=PWM_WH2 PWM_UL=PWM_WL2 PWM_VH=PWM_VH2 PWM_VL=PWM_VL2 PWM_WH=PWM_UH2 PWM_WL=PWM_UL2 SH_U=OUT_W2 SH_V=OUT_V2 SH_W=OUT_U2 VDD=VBAT
U_Motors/U_Half Bridge Driver_3: designators end in _3; ports GND=GND GU_H=GU_H3 GU_L=GU_L3 GV_H=GV_H3 GV_L=GV_L3 GW_H=GW_H3 GW_L=GW_L3 PWM_UH=PWM_UH3 PWM_UL=PWM_UL3 PWM_VH=PWM_VH3 PWM_VL=PWM_VL3 PWM_WH=PWM_WH3 PWM_WL=PWM_WL3 SH_U=OUT_U3 SH_V=OUT_V3 SH_W=OUT_W3 VDD=VBAT
U_Motors/U_Half Bridge Driver_4: designators end in _4; ports GND=GND GU_H=GW_H4 GU_L=GW_L4 GV_H=GV_H4 GV_L=GV_L4 GW_H=GU_H4 GW_L=GU_L4 PWM_UH=PWM_WH4 PWM_UL=PWM_WL4 PWM_VH=PWM_VH4 PWM_VL=PWM_VL4 PWM_WH=PWM_UH4 PWM_WL=PWM_UL4 SH_U=OUT_W4 SH_V=OUT_V4 SH_W=OUT_U4 VDD=VBAT

### Notes on the sheet
- of

### Library data of the parts
C1-C3 = GRT033R6YA104KE01D: CAP CER 0.1UF 35V X5R 0201; manufacturer: Murata Electronics; Tolerance: ±10%; Part Number: GRT033R6YA104KE01D; Value: 0.1 µF; Applications: Automotive; Capacitance: 0.1 µF; componentlink1description: Datasheet; componentlink1url: https://search.murata.co.jp/Ceramy/image/img/A01X/G101/ENG/GRT033R6YA104KE01-01.pdf; componentlink2description: DigiKey Link; componentlink2url: https://www.digikey.com/en/products/detail/murata-electronics/GRT033R6YA104KE01D/10694796; Device Package: 0201 (0603 Metric); lastupdated: 7/15/2023 7:00:43 PM; Lifecycle Status: Active; Minimum Order: 1; Mounting Type: Surface Mount, MLCC; Operating Temperature: -55°C ~ 85°C; Package / Case: 0201 (0603 Metric); packaging: TapeAndReel; partid: 49925; Part Status: Active; price: 0.01; Ratings: AEC-Q200; series: GRT; Size / Dimension: 0.024" L x 0.012" W (0.60mm x 0.30mm); Supplier 1: DigiKey; Supplier Part Number 1: 490-GRT033R6YA104KE01DCT-ND; Temperature Coefficient: X5R; Thickness (Max): 0.013" (0.33mm); Voltage - Rated: 35V
D1-D3 = Diode: DFN1608D-2 (SOD1608); Manufacturer: Cree; ComponentLink2Description: Datasheet; Temperature: -40°C to +100°C; Package: LED_3MM2X2MM8; Supplier 2: Mouser; Price: 0.203999996142; Supplier 1: Digi-Key; ComponentLink1URL: https://upverter.com/upn/revision/9d0b31f7b1982705/; Supplier Part Number 2: 941-CLV1LFKBC7673673; Supplier Part Number 1: CLV1L-FKB-CHMMQEHBB7673673-ND; ComponentLink1Description: Upverter; ComponentLink2URL: http://www.cree.com/~/media/Files/Cree/LED-Components-and-Modules/HB/Data-Sheets/CLV1L-FKB-1238.pdf; RoHS: TRUE; Mouser Part Number: 941-CLV1LFKBC7673673; Temperature Range High: +100°C; Digikey Description: DIODE LED RGB DIFFUSED 4LCC SMD; Digikey Part Number: CLV1L-FKB-CHMMQEHBB7673673-ND; Lead Free: yes; Temperature Range Low: -40°C
R3 R13-R17 = RK73H1ETTP1432F: RES 14.3K OHM 1% 1/10W 0402; Manufacturer: KOA Speer Electronics, Inc.; Power (Watts): 0.1W, 1/10W; Resistance: 14.3 kOhms; Temperature Coefficient: ±100ppm/°C; Part Number: RK73H1ETTP1432F; Value: 22 Ohm; ComponentLink1Description: Datasheet; ComponentLink1URL: http://www.koaspeer.com/catimages/Products/RK73H/RK73H.pdf; ComponentLink2Description: DigiKey Link; ComponentLink2URL: https://www.digikey.com/en/products/detail/koa-speer-electronics-inc/RK73H1ETTP1432F/9844351; Composition: Thick Film; Device Package: 0402 (1005 Metric); Features: Automotive AEC-Q200, Moisture Resistant; Height - Seated (Max): 0.016" (0.40mm); LastUpdated: 8/14/2022 9:23:49 PM; Lifecycle Status: Active; Minimum Order: 1; Number of Terminations: 2; Operating Temperature: -55°C ~ 155°C; Package / Case: 0402 (1005 Metric); Packaging: CutTape; PartId: 10193; Part Status: Active; Price: 0.01; Ratings: AEC-Q200; Series: RK73H; Size / Dimension: 0.039" L x 0.020" W (1.00mm x 0.50mm); Supplier 1: DigiKey; Supplier Part Number 1: 2019-RK73H1ETTP1432FCT-ND; Supplier Device Package: 0402; Tolerance: ±1%
R20-R22 = CRCW020110K0FKED: as R2 on sheet ESC_4in1; Part Number: CRCW020110K0FKED; Value: 10k; ComponentLink1Description: Datasheet; ComponentLink1URL: http://www.vishay.com/docs/20052/crcw0201e3.pdf; ComponentLink2Description: DigiKey Link; ComponentLink2URL: https://www.digikey.com/en/products/detail/vishay-dale/CRCW020110K0FKED/1967989; Composition: Thick Film; Device Package: 0201 (0603 Metric); Height - Seated (Max): 0.010" (0.26mm); LastUpdated: 7/12/2023 7:17:23 PM; Lifecycle Status: Active; Minimum Order: 1; Number of Terminations: 2; Operating Temperature: -55°C ~ 155°C; Package / Case: 0201 (0603 Metric); Packaging: TapeAndReel; PartId: 29; Part Status: Active; Price: 0.02; Series: CRCW; Size / Dimension: 0.024" L x 0.012" W (0.60mm x 0.30mm); Supplier 1: DigiKey; Supplier Part Number 1: 541-10.0KAABCT-ND; Supplier Device Package: 0201; Tolerance: ±1%
U1 = FD6288Q: 3 Phase Gate Driver 1.5-2.2A; MF: Texas Instruments; MP: UCC27282DRCR; Texas_Instruments-Purchase-URL: https://snapeda.com/shop?store=Texas+Instruments&id=3625400; Price: None; Availability: Warning; Package: VSON-10 Texas Instruments; SnapEDA_Link: https://www.snapeda.com/parts/UCC27282DRCR/Texas%20Instruments/view-part/3625400/?ref=snap; DigiKey-Purchase-URL: https://snapeda.com/shop?store=DigiKey&id=3625400; Value: *

## Sheet CurrentSenseAmp.SchDoc
size A; SheetNumber: 7; SheetTotal: 8
Used 4 times, as channels U_Motors/U_CurrentSenseAmp, U_Motors/U_CurrentSenseAmp, U_Motors/U_CurrentSenseAmp, U_Motors/U_CurrentSenseAmp. Parts and nets are listed once, with the designators drawn on the sheet.
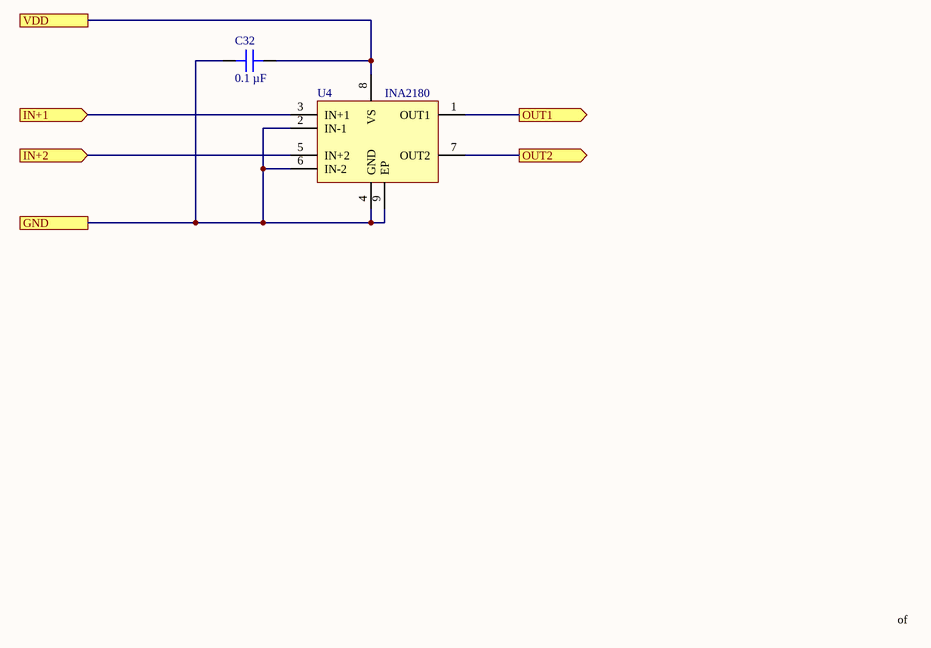
[diagram p6: CurrentSenseAmp.SchDoc]

### Parts
C32  0.1 µF  [CAP 0201_0603]
U4  INA2180  [WSON-8_2x2]

### Ports
GND, IN+1 (in), IN+2 (in), OUT1 (out), OUT2 (out), VDD

### Nets
GND: C32.1 U4.2(IN-1) U4.4(GND) U4.6(IN-2) U4.9(EP) ; port GND
IN+1: U4.3(IN+1) ; port IN+1
IN+2: U4.5(IN+2) ; port IN+2
OUT1: U4.1(OUT1) ; port OUT1
OUT2: U4.7(OUT2) ; port OUT2
VDD: C32.2 U4.8(VS) ; port VDD

### Channels
U_Motors/U_CurrentSenseAmp: designators C32=C32_1 U4=U4_2; ports GND=GND IN+1=VSS_U_R1 IN+2=VSS_V_R1 OUT1=ISNS_U1 OUT2=ISNS_V1 VDD=3V3_MCU1
U_Motors/U_CurrentSenseAmp: designators C32=C32_2 U4=U4_1; ports GND=GND IN+1=VSS_V_R2 IN+2=VSS_U_R2 OUT1=ISNS_V2 OUT2=ISNS_U2 VDD=3V3_MCU1
U_Motors/U_CurrentSenseAmp: designators end in _3; ports GND=GND IN+1=VSS_U_R3 IN+2=VSS_V_R3 OUT1=ISNS_U3 OUT2=ISNS_V3 VDD=3V3_MCU2
U_Motors/U_CurrentSenseAmp: designators end in _4; ports GND=GND IN+1=VSS_V_R4 IN+2=VSS_U_R4 OUT1=ISNS_V4 OUT2=ISNS_U4 VDD=3V3_MCU2

### Notes on the sheet
- of

### Library data of the parts
C32 = GRT033R6YA104KE01D: as C1 on sheet Half_Bridge_Driver; Part Number: GRT033R6YA104KE01D; Value: 0.1 µF; Applications: Automotive; Capacitance: 0.1 µF; componentlink1description: Datasheet; componentlink1url: https://search.murata.co.jp/Ceramy/image/img/A01X/G101/ENG/GRT033R6YA104KE01-01.pdf; componentlink2description: DigiKey Link; componentlink2url: https://www.digikey.com/en/products/detail/murata-electronics/GRT033R6YA104KE01D/10694796; Device Package: 0201 (0603 Metric); lastupdated: 7/15/2023 7:00:43 PM; Lifecycle Status: Active; Minimum Order: 1; Mounting Type: Surface Mount, MLCC; Operating Temperature: -55°C ~ 85°C; Package / Case: 0201 (0603 Metric); packaging: TapeAndReel; partid: 49925; Part Status: Active; price: 0.01; Ratings: AEC-Q200; series: GRT; Size / Dimension: 0.024" L x 0.012" W (0.60mm x 0.30mm); Supplier 1: DigiKey; Supplier Part Number 1: 490-GRT033R6YA104KE01DCT-ND; Temperature Coefficient: X5R; Thickness (Max): 0.013" (0.33mm); Voltage - Rated: 35V
U4 = INA2180: Current sense amplifier 4 channel

## Sheet MCUs.SchDoc
size B; SheetNumber: 8; SheetTotal: 8
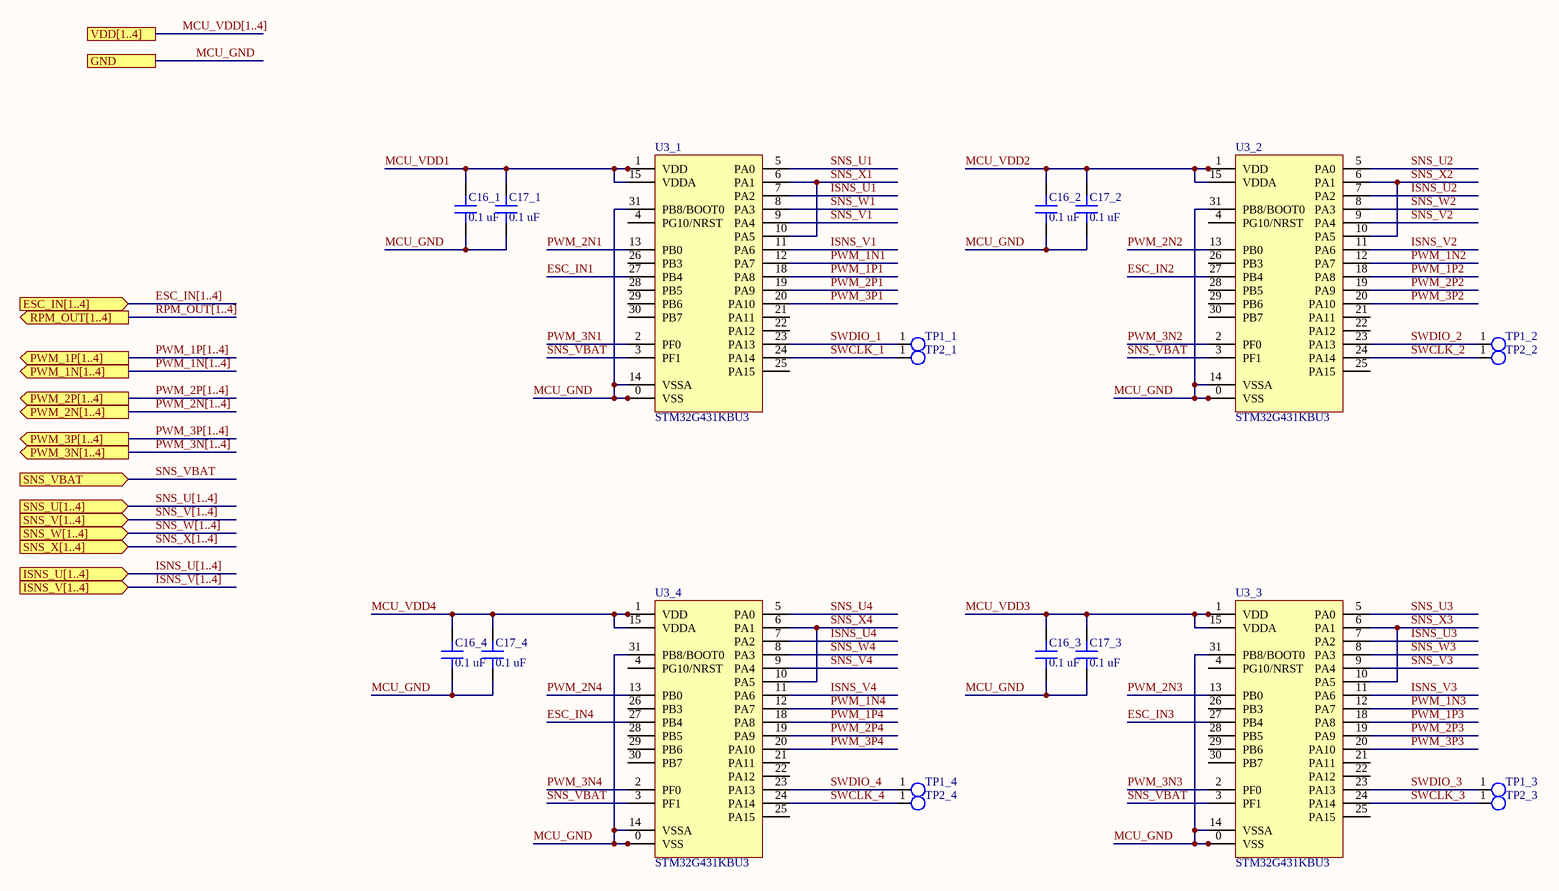
[diagram p7: MCUs.SchDoc]

### Parts
C16_1  0.1 uF  [CAP 0201_0603]
C16_2  0.1 uF  [CAP 0201_0603]
C16_3  0.1 uF  [CAP 0201_0603]
C16_4  0.1 uF  [CAP 0201_0603]
C17_1  0.1 uF  [CAP 0201_0603]
C17_2  0.1 uF  [CAP 0201_0603]
C17_3  0.1 uF  [CAP 0201_0603]
C17_4  0.1 uF  [CAP 0201_0603]
TP1_1  0.8mm  [TP  0.8mm]  (value not drawn)
TP1_2  0.8mm  [TP  0.8mm]  (value not drawn)
TP1_3  0.8mm  [TP  0.8mm]  (value not drawn)
TP1_4  0.8mm  [TP  0.8mm]  (value not drawn)
TP2_1  0.8mm  [TP  0.8mm]  (value not drawn)
TP2_2  0.8mm  [TP  0.8mm]  (value not drawn)
TP2_3  0.8mm  [TP  0.8mm]  (value not drawn)
TP2_4  0.8mm  [TP  0.8mm]  (value not drawn)
U3_1  STM32G431KBU3  [QFN50P400X400X60-32N]
U3_2  STM32G431KBU3  [QFN50P400X400X60-32N]
U3_3  STM32G431KBU3  [QFN50P400X400X60-32N]
U3_4  STM32G431KBU3  [QFN50P400X400X60-32N]

### Ports
ESC_IN[1..4] (in), GND, ISNS_U[1..4] (in), ISNS_V[1..4] (in), PWM_1N[1..4] (out), PWM_1P[1..4] (out), PWM_2N[1..4] (out), PWM_2P[1..4] (out), PWM_3N[1..4] (out), PWM_3P[1..4] (out), RPM_OUT[1..4] (out), SNS_U[1..4] (in), SNS_V[1..4] (in), SNS_VBAT (in), SNS_W[1..4] (in), SNS_X[1..4] (in), VDD[1..4]

### Nets
MCU_GND: C16_1.1 C16_2.1 C16_3.1 C16_4.1 C17_1.1 C17_2.1 C17_3.1 C17_4.1 U3_1.0(VSS) U3_1.14(VSSA) U3_1.16(VSS) U3_1.31(PB8/BOOT0) U3_1.32(VSS) U3_2.0(VSS) U3_2.14(VSSA) U3_2.16(VSS) U3_2.31(PB8/BOOT0) U3_2.32(VSS) U3_3.0(VSS) U3_3.14(VSSA) U3_3.16(VSS) U3_3.31(PB8/BOOT0) U3_3.32(VSS) U3_4.0(VSS) U3_4.14(VSSA) U3_4.16(VSS) U3_4.31(PB8/BOOT0) U3_4.32(VSS) ; port GND  [project net GND]
MCU_VDD1: C16_1.2 C16_2.2 C17_1.2 C17_2.2 U3_1.1(VDD) U3_1.15(VDDA) U3_1.17(VDD) U3_2.1(VDD) U3_2.15(VDDA) U3_2.17(VDD)  [also labelled MCU_VDD2]  [project net 3V3_MCU1]
MCU_VDD3: C16_3.2 C16_4.2 C17_3.2 C17_4.2 U3_3.1(VDD) U3_3.15(VDDA) U3_3.17(VDD) U3_4.1(VDD) U3_4.15(VDDA) U3_4.17(VDD)  [also labelled MCU_VDD4]  [project net 3V3_MCU2]
ESC_IN1: U3_1.27(PB4)  [project net ESC1]
ESC_IN2: U3_2.27(PB4)  [project net ESC2]
ESC_IN3: U3_3.27(PB4)  [project net ESC3]
ESC_IN4: U3_4.27(PB4)  [project net ESC4]
ISNS_U1: U3_1.7(PA2)
ISNS_U2: U3_2.7(PA2)
ISNS_U3: U3_3.7(PA2)
ISNS_U4: U3_4.7(PA2)
ISNS_V1: U3_1.11(PA6)
ISNS_V2: U3_2.11(PA6)
ISNS_V3: U3_3.11(PA6)
ISNS_V4: U3_4.11(PA6)
PWM_1N1: U3_1.12(PA7)  [project net PWM_UL1]
PWM_1N2: U3_2.12(PA7)  [project net PWM_UL2]
PWM_1N3: U3_3.12(PA7)  [project net PWM_UL3]
PWM_1N4: U3_4.12(PA7)  [project net PWM_UL4]
PWM_1P1: U3_1.18(PA8)  [project net PWM_UH1]
PWM_1P2: U3_2.18(PA8)  [project net PWM_UH2]
PWM_1P3: U3_3.18(PA8)  [project net PWM_UH3]
PWM_1P4: U3_4.18(PA8)  [project net PWM_UH4]
PWM_2N1: U3_1.13(PB0)  [project net PWM_VL1]
PWM_2N2: U3_2.13(PB0)  [project net PWM_VL2]
PWM_2N3: U3_3.13(PB0)  [project net PWM_VL3]
PWM_2N4: U3_4.13(PB0)  [project net PWM_VL4]
PWM_2P1: U3_1.19(PA9)  [project net PWM_VH1]
PWM_2P2: U3_2.19(PA9)  [project net PWM_VH2]
PWM_2P3: U3_3.19(PA9)  [project net PWM_VH3]
PWM_2P4: U3_4.19(PA9)  [project net PWM_VH4]
PWM_3N1: U3_1.2(PF0)  [project net PWM_WL1]
PWM_3N2: U3_2.2(PF0)  [project net PWM_WL2]
PWM_3N3: U3_3.2(PF0)  [project net PWM_WL3]
PWM_3N4: U3_4.2(PF0)  [project net PWM_WL4]
PWM_3P1: U3_1.20(PA10)  [project net PWM_WH1]
PWM_3P2: U3_2.20(PA10)  [project net PWM_WH2]
PWM_3P3: U3_3.20(PA10)  [project net PWM_WH3]
PWM_3P4: U3_4.20(PA10)  [project net PWM_WH4]
SNS_U1: U3_1.5(PA0)
SNS_U2: U3_2.5(PA0)
SNS_U3: U3_3.5(PA0)
SNS_U4: U3_4.5(PA0)
SNS_V1: U3_1.9(PA4)
SNS_V2: U3_2.9(PA4)
SNS_V3: U3_3.9(PA4)
SNS_V4: U3_4.9(PA4)
SNS_VBAT: U3_1.3(PF1) U3_2.3(PF1) U3_3.3(PF1) U3_4.3(PF1) ; port SNS_VBAT
SNS_W1: U3_1.8(PA3)
SNS_W2: U3_2.8(PA3)
SNS_W3: U3_3.8(PA3)
SNS_W4: U3_4.8(PA3)
SNS_X1: U3_1.6(PA1) U3_1.10(PA5)
SNS_X2: U3_2.6(PA1) U3_2.10(PA5)
SNS_X3: U3_3.6(PA1) U3_3.10(PA5)
SNS_X4: U3_4.6(PA1) U3_4.10(PA5)
SWCLK_1: TP2_1.1(TP) U3_1.24(PA14)
SWCLK_2: TP2_2.1(TP) U3_2.24(PA14)
SWCLK_3: TP2_3.1(TP) U3_3.24(PA14)
SWCLK_4: TP2_4.1(TP) U3_4.24(PA14)
SWDIO_1: TP1_1.1(TP) U3_1.23(PA13)
SWDIO_2: TP1_2.1(TP) U3_2.23(PA13)
SWDIO_3: TP1_3.1(TP) U3_3.23(PA13)
SWDIO_4: TP1_4.1(TP) U3_4.23(PA13)

Not connected (* = marked no-connect by the designer): U3_1 4(PG10/NRST) 21(PA11) 22(PA12) 25(PA15) 26(PB3) 28(PB5) 29(PB6) 30(PB7); U3_2 4(PG10/NRST) 21(PA11) 22(PA12) 25(PA15) 26(PB3) 28(PB5) 29(PB6) 30(PB7); U3_3 4(PG10/NRST) 21(PA11) 22(PA12) 25(PA15) 26(PB3) 28(PB5) 29(PB6) 30(PB7); U3_4 4(PG10/NRST) 21(PA11) 22(PA12) 25(PA15) 26(PB3) 28(PB5) 29(PB6) 30(PB7)

### Buses and harness runs
bus ESC_IN[1..4] = port ESC_IN[1..4]
bus ISNS_U[1..4] = port ISNS_U[1..4]
bus ISNS_V[1..4] = port ISNS_V[1..4]
bus MCU_VDD[1..4] = port VDD[1..4]
bus PWM_1N[1..4] = port PWM_1N[1..4]
bus PWM_1P[1..4] = port PWM_1P[1..4]
bus PWM_2N[1..4] = port PWM_2N[1..4]
bus PWM_2P[1..4] = port PWM_2P[1..4]
bus PWM_3N[1..4] = port PWM_3N[1..4]
bus PWM_3P[1..4] = port PWM_3P[1..4]
bus RPM_OUT[1..4] = port RPM_OUT[1..4]
bus SNS_U[1..4] = port SNS_U[1..4]
bus SNS_V[1..4] = port SNS_V[1..4]
bus SNS_W[1..4] = port SNS_W[1..4]
bus SNS_X[1..4] = port SNS_X[1..4]

### Library data of the parts
C16_1-C16_4 C17_1-C17_4 = GRT033R6YA104KE01D: as C37 on sheet ESC_4in1; Part Number: GRT033R6YA104KE01D; Value: 0.1 uF; Applications: Automotive; componentlink1description: Datasheet; componentlink1url: https://search.murata.co.jp/Ceramy/image/img/A01X/G101/ENG/GRT033R6YA104KE01-01.pdf; componentlink2description: DigiKey Link; componentlink2url: https://www.digikey.com/en/products/detail/murata-electronics/GRT033R6YA104KE01D/10694796; Device Package: 0201 (0603 Metric); lastupdated: 7/15/2023 7:00:43 PM; Lifecycle Status: Active; Minimum Order: 1; Mounting Type: Surface Mount, MLCC; Operating Temperature: -55°C ~ 85°C; Package / Case: 0201 (0603 Metric); packaging: TapeAndReel; partid: 49925; Part Status: Active; price: 0.01; Ratings: AEC-Q200; series: GRT; Size / Dimension: 0.024" L x 0.012" W (0.60mm x 0.30mm); Supplier 1: DigiKey; Supplier Part Number 1: 490-GRT033R6YA104KE01DCT-ND; Temperature Coefficient: X5R; Thickness (Max): 0.013" (0.33mm); Voltage - Rated: 35V
TP1_1-TP1_4 TP2_1-TP2_4 = TP 0.8mm: Test point
U3_1-U3_4 = STM32G431KBU3: MCU UFQFPN-32

## Nets that join several sheets
3V3_MCU1: U_3V3_LDO_1 (C7_1.1 U5_1.1), U_Motors/U_CurrentSenseAmp (C32_1.2 U4_2.8), U_Motors/U_CurrentSenseAmp (C32_2.2 U4_1.8), MCUs (10 pins)
3V3_MCU2: U_Motors/U_CurrentSenseAmp (C32_3.2 U4_3.8), U_Motors/U_CurrentSenseAmp (C32_4.2 U4_4.8), MCUs (10 pins), U_3V3_LDO_2 (C7_2.1 U5_2.1)
5V: 5V_buck (C12.2 L1.2 U2.1), U_3V3_LDO_1 (C6_1.1 U5_1.3 U5_1.4), U_3V3_LDO_2 (C6_2.1 U5_2.3 U5_2.4)
GND: ESC_4in1 (32 pins), 5V_buck (C12.1 C15.2 U2.4), U_3V3_LDO_1 (C6_1.2 C7_1.2 U5_1.2 U5_1.5), U_Motors/U_MOSFETs1 (11 pins), U_Motors/U_MOSFETs2 (11 pins), U_Motors/U_MOSFETs3 (11 pins), U_Motors/U_MOSFETs4 (11 pins), U_Motors/U_Half Bridge Driver_1 (5 pins), U_Motors/U_Half Bridge Driver_2 (5 pins), U_Motors/U_Half Bridge Driver_3 (5 pins), U_Motors/U_Half Bridge Driver_4 (5 pins), U_Motors/U_CurrentSenseAmp (5 pins), U_Motors/U_CurrentSenseAmp (5 pins), U_Motors/U_CurrentSenseAmp (5 pins), U_Motors/U_CurrentSenseAmp (5 pins), MCUs (28 pins), U_3V3_LDO_2 (C6_2.2 C7_2.2 U5_2.2 U5_2.5)
VBAT: ESC_4in1 (31 pins), 5V_buck (C15.1 U2.2 U2.3), U_Motors/U_MOSFETs1 (12 pins), U_Motors/U_MOSFETs2 (12 pins), U_Motors/U_MOSFETs3 (12 pins), U_Motors/U_MOSFETs4 (12 pins), U_Motors/U_Half Bridge Driver_1 (D1_1.2 D2_1.2 D3_1.2 U1_1.4), U_Motors/U_Half Bridge Driver_2 (D1_2.2 D2_2.2 D3_2.2 U1_2.4), U_Motors/U_Half Bridge Driver_3 (D1_3.2 D2_3.2 D3_3.2 U1_3.4), U_Motors/U_Half Bridge Driver_4 (D1_4.2 D2_4.2 D3_4.2 U1_4.4)
GU_H1: U_Motors/U_MOSFETs1 (Q1_1.4), U_Motors/U_Half Bridge Driver_1 (R3_1.2)
GU_H2: U_Motors/U_MOSFETs2 (Q1_2.4), U_Motors/U_Half Bridge Driver_2 (R16_2.2)
GU_H3: U_Motors/U_MOSFETs3 (Q1_3.4), U_Motors/U_Half Bridge Driver_3 (R3_3.2)
GU_H4: U_Motors/U_MOSFETs4 (Q1_4.4), U_Motors/U_Half Bridge Driver_4 (R16_4.2)
GU_L1: U_Motors/U_MOSFETs1 (Q4_1.4), U_Motors/U_Half Bridge Driver_1 (R13_1.2)
GU_L2: U_Motors/U_MOSFETs2 (Q4_2.4), U_Motors/U_Half Bridge Driver_2 (R17_2.2)
GU_L3: U_Motors/U_MOSFETs3 (Q4_3.4), U_Motors/U_Half Bridge Driver_3 (R13_3.2)
GU_L4: U_Motors/U_MOSFETs4 (Q4_4.4), U_Motors/U_Half Bridge Driver_4 (R17_4.2)
GV_H1: U_Motors/U_MOSFETs1 (Q2_1.4), U_Motors/U_Half Bridge Driver_1 (R14_1.2)
GV_H2: U_Motors/U_MOSFETs2 (Q2_2.4), U_Motors/U_Half Bridge Driver_2 (R14_2.2)
GV_H3: U_Motors/U_MOSFETs3 (Q2_3.4), U_Motors/U_Half Bridge Driver_3 (R14_3.2)
GV_H4: U_Motors/U_MOSFETs4 (Q2_4.4), U_Motors/U_Half Bridge Driver_4 (R14_4.2)
GV_L1: U_Motors/U_MOSFETs1 (Q5_1.4), U_Motors/U_Half Bridge Driver_1 (R15_1.2)
GV_L2: U_Motors/U_MOSFETs2 (Q5_2.4), U_Motors/U_Half Bridge Driver_2 (R15_2.2)
GV_L3: U_Motors/U_MOSFETs3 (Q5_3.4), U_Motors/U_Half Bridge Driver_3 (R15_3.2)
GV_L4: U_Motors/U_MOSFETs4 (Q5_4.4), U_Motors/U_Half Bridge Driver_4 (R15_4.2)
GW_H1: U_Motors/U_MOSFETs1 (Q3_1.4), U_Motors/U_Half Bridge Driver_1 (R16_1.2)
GW_H2: U_Motors/U_MOSFETs2 (Q3_2.4), U_Motors/U_Half Bridge Driver_2 (R3_2.2)
GW_H3: U_Motors/U_MOSFETs3 (Q3_3.4), U_Motors/U_Half Bridge Driver_3 (R16_3.2)
GW_H4: U_Motors/U_MOSFETs4 (Q3_4.4), U_Motors/U_Half Bridge Driver_4 (R3_4.2)
GW_L1: U_Motors/U_MOSFETs1 (Q6_1.4), U_Motors/U_Half Bridge Driver_1 (R17_1.2)
GW_L2: U_Motors/U_MOSFETs2 (Q6_2.4), U_Motors/U_Half Bridge Driver_2 (R13_2.2)
GW_L3: U_Motors/U_MOSFETs3 (Q6_3.4), U_Motors/U_Half Bridge Driver_3 (R17_3.2)
GW_L4: U_Motors/U_MOSFETs4 (Q6_4.4), U_Motors/U_Half Bridge Driver_4 (R13_4.2)
ISNS_U1: U_Motors/U_CurrentSenseAmp (U4_2.1), MCUs (U3_1.7)
ISNS_U2: U_Motors/U_CurrentSenseAmp (U4_1.7), MCUs (U3_2.7)
ISNS_U3: U_Motors/U_CurrentSenseAmp (U4_3.1), MCUs (U3_3.7)
ISNS_U4: U_Motors/U_CurrentSenseAmp (U4_4.7), MCUs (U3_4.7)
ISNS_V1: U_Motors/U_CurrentSenseAmp (U4_2.7), MCUs (U3_1.11)
ISNS_V2: U_Motors/U_CurrentSenseAmp (U4_1.1), MCUs (U3_2.11)
ISNS_V3: U_Motors/U_CurrentSenseAmp (U4_3.7), MCUs (U3_3.11)
ISNS_V4: U_Motors/U_CurrentSenseAmp (U4_4.1), MCUs (U3_4.11)
OUT_U1: U_Motors/U_MOSFETs1 (8 pins), U_Motors/U_Half Bridge Driver_1 (C3_1.2 U1_1.18)
OUT_U2: U_Motors/U_MOSFETs2 (8 pins), U_Motors/U_Half Bridge Driver_2 (C1_2.2 U1_2.12)
OUT_U3: U_Motors/U_MOSFETs3 (8 pins), U_Motors/U_Half Bridge Driver_3 (C3_3.2 U1_3.18)
OUT_U4: U_Motors/U_MOSFETs4 (8 pins), U_Motors/U_Half Bridge Driver_4 (C1_4.2 U1_4.12)
OUT_V1: U_Motors/U_MOSFETs1 (8 pins), U_Motors/U_Half Bridge Driver_1 (C2_1.2 U1_1.15)
OUT_V2: U_Motors/U_MOSFETs2 (8 pins), U_Motors/U_Half Bridge Driver_2 (C2_2.2 U1_2.15)
OUT_V3: U_Motors/U_MOSFETs3 (8 pins), U_Motors/U_Half Bridge Driver_3 (C2_3.2 U1_3.15)
OUT_V4: U_Motors/U_MOSFETs4 (8 pins), U_Motors/U_Half Bridge Driver_4 (C2_4.2 U1_4.15)
OUT_W1: U_Motors/U_MOSFETs1 (8 pins), U_Motors/U_Half Bridge Driver_1 (C1_1.2 U1_1.12)
OUT_W2: U_Motors/U_MOSFETs2 (8 pins), U_Motors/U_Half Bridge Driver_2 (C3_2.2 U1_2.18)
OUT_W3: U_Motors/U_MOSFETs3 (8 pins), U_Motors/U_Half Bridge Driver_3 (C1_3.2 U1_3.12)
OUT_W4: U_Motors/U_MOSFETs4 (8 pins), U_Motors/U_Half Bridge Driver_4 (C3_4.2 U1_4.18)
PWM_UH1: U_Motors/U_Half Bridge Driver_1 (U1_1.22), MCUs (U3_1.18)
PWM_UH2: U_Motors/U_Half Bridge Driver_2 (U1_2.24), MCUs (U3_2.18)
PWM_UH3: U_Motors/U_Half Bridge Driver_3 (U1_3.22), MCUs (U3_3.18)
PWM_UH4: U_Motors/U_Half Bridge Driver_4 (U1_4.24), MCUs (U3_4.18)
PWM_UL1: U_Motors/U_Half Bridge Driver_1 (U1_1.1), MCUs (U3_1.12)
PWM_UL2: U_Motors/U_Half Bridge Driver_2 (U1_2.3), MCUs (U3_2.12)
PWM_UL3: U_Motors/U_Half Bridge Driver_3 (U1_3.1), MCUs (U3_3.12)
PWM_UL4: U_Motors/U_Half Bridge Driver_4 (U1_4.3), MCUs (U3_4.12)
PWM_VH1: U_Motors/U_Half Bridge Driver_1 (U1_1.23), MCUs (U3_1.19)
PWM_VH2: U_Motors/U_Half Bridge Driver_2 (U1_2.23), MCUs (U3_2.19)
PWM_VH3: U_Motors/U_Half Bridge Driver_3 (U1_3.23), MCUs (U3_3.19)
PWM_VH4: U_Motors/U_Half Bridge Driver_4 (U1_4.23), MCUs (U3_4.19)
PWM_VL1: U_Motors/U_Half Bridge Driver_1 (U1_1.2), MCUs (U3_1.13)
PWM_VL2: U_Motors/U_Half Bridge Driver_2 (U1_2.2), MCUs (U3_2.13)
PWM_VL3: U_Motors/U_Half Bridge Driver_3 (U1_3.2), MCUs (U3_3.13)
PWM_VL4: U_Motors/U_Half Bridge Driver_4 (U1_4.2), MCUs (U3_4.13)
PWM_WH1: U_Motors/U_Half Bridge Driver_1 (U1_1.24), MCUs (U3_1.20)
PWM_WH2: U_Motors/U_Half Bridge Driver_2 (U1_2.22), MCUs (U3_2.20)
PWM_WH3: U_Motors/U_Half Bridge Driver_3 (U1_3.24), MCUs (U3_3.20)
PWM_WH4: U_Motors/U_Half Bridge Driver_4 (U1_4.22), MCUs (U3_4.20)
PWM_WL1: U_Motors/U_Half Bridge Driver_1 (U1_1.3), MCUs (U3_1.2)
PWM_WL2: U_Motors/U_Half Bridge Driver_2 (U1_2.1), MCUs (U3_2.2)
PWM_WL3: U_Motors/U_Half Bridge Driver_3 (U1_3.3), MCUs (U3_3.2)
PWM_WL4: U_Motors/U_Half Bridge Driver_4 (U1_4.1), MCUs (U3_4.2)
SNS_U1: U_Motors/U_MOSFETs1 (C38_1.1 R4_1.2 R5_1.1 R10_1.1), MCUs (U3_1.5)
SNS_U2: U_Motors/U_MOSFETs2 (C38_2.1 R4_2.2 R5_2.1 R10_2.1), MCUs (U3_2.5)
SNS_U3: U_Motors/U_MOSFETs3 (C38_3.1 R4_3.2 R5_3.1 R10_3.1), MCUs (U3_3.5)
SNS_U4: U_Motors/U_MOSFETs4 (C38_4.1 R4_4.2 R5_4.1 R10_4.1), MCUs (U3_4.5)
SNS_V1: U_Motors/U_MOSFETs1 (C39_1.1 R6_1.2 R7_1.1 R11_1.1), MCUs (U3_1.9)
SNS_V2: U_Motors/U_MOSFETs2 (C39_2.1 R6_2.2 R7_2.1 R11_2.1), MCUs (U3_2.9)
SNS_V3: U_Motors/U_MOSFETs3 (C39_3.1 R6_3.2 R7_3.1 R11_3.1), MCUs (U3_3.9)
SNS_V4: U_Motors/U_MOSFETs4 (C39_4.1 R6_4.2 R7_4.1 R11_4.1), MCUs (U3_4.9)
SNS_VBAT: ESC_4in1 (C37.2 R2.1 R19.2), MCUs (U3_1.3 U3_2.3 U3_3.3 U3_4.3)
SNS_W1: U_Motors/U_MOSFETs1 (C40_1.1 R8_1.2 R9_1.1 R12_1.1), MCUs (U3_1.8)
SNS_W2: U_Motors/U_MOSFETs2 (C40_2.1 R8_2.2 R9_2.1 R12_2.1), MCUs (U3_2.8)
SNS_W3: U_Motors/U_MOSFETs3 (C40_3.1 R8_3.2 R9_3.1 R12_3.1), MCUs (U3_3.8)
SNS_W4: U_Motors/U_MOSFETs4 (C40_4.1 R8_4.2 R9_4.1 R12_4.1), MCUs (U3_4.8)
SNS_X1: U_Motors/U_MOSFETs1 (R4_1.1 R6_1.1 R8_1.1), MCUs (U3_1.6 U3_1.10)
SNS_X2: U_Motors/U_MOSFETs2 (R4_2.1 R6_2.1 R8_2.1), MCUs (U3_2.6 U3_2.10)
SNS_X3: U_Motors/U_MOSFETs3 (R4_3.1 R6_3.1 R8_3.1), MCUs (U3_3.6 U3_3.10)
SNS_X4: U_Motors/U_MOSFETs4 (R4_4.1 R6_4.1 R8_4.1), MCUs (U3_4.6 U3_4.10)
VSS_U_R1: U_Motors/U_MOSFETs1 (Q4_1.1 Q4_1.2 Q4_1.3 R1_1.2), U_Motors/U_CurrentSenseAmp (U4_2.3)
VSS_U_R2: U_Motors/U_MOSFETs2 (Q4_2.1 Q4_2.2 Q4_2.3 R1_2.2), U_Motors/U_CurrentSenseAmp (U4_1.5)
VSS_U_R3: U_Motors/U_MOSFETs3 (Q4_3.1 Q4_3.2 Q4_3.3 R1_3.2), U_Motors/U_CurrentSenseAmp (U4_3.3)
VSS_U_R4: U_Motors/U_MOSFETs4 (Q4_4.1 Q4_4.2 Q4_4.3 R1_4.2), U_Motors/U_CurrentSenseAmp (U4_4.5)
VSS_V_R1: U_Motors/U_MOSFETs1 (Q5_1.1 Q5_1.2 Q5_1.3 R18_1.2), U_Motors/U_CurrentSenseAmp (U4_2.5)
VSS_V_R2: U_Motors/U_MOSFETs2 (Q5_2.1 Q5_2.2 Q5_2.3 R18_2.2), U_Motors/U_CurrentSenseAmp (U4_1.3)
VSS_V_R3: U_Motors/U_MOSFETs3 (Q5_3.1 Q5_3.2 Q5_3.3 R18_3.2), U_Motors/U_CurrentSenseAmp (U4_3.5)
VSS_V_R4: U_Motors/U_MOSFETs4 (Q5_4.1 Q5_4.2 Q5_4.3 R18_4.2), U_Motors/U_CurrentSenseAmp (U4_4.3)

## Assembly variants
Main: all parts fitted